# Altium project MU_MP_39_V1.PrjPcb (part 3 of 5)

## Sheet 09 EMMC.SchDoc
size 420 x 297 mm; Address1: Address1; Address2: Address2; Address3: Address3; Address4: Address4; DocumentNumber: АБВГ.123456.001 Э3; SheetNumber: 9; SheetTotal: 23; Scale: 1:1; DocumentType: Схема электрическая принципиальная; FirstReferrence: АБВГ.123456.001
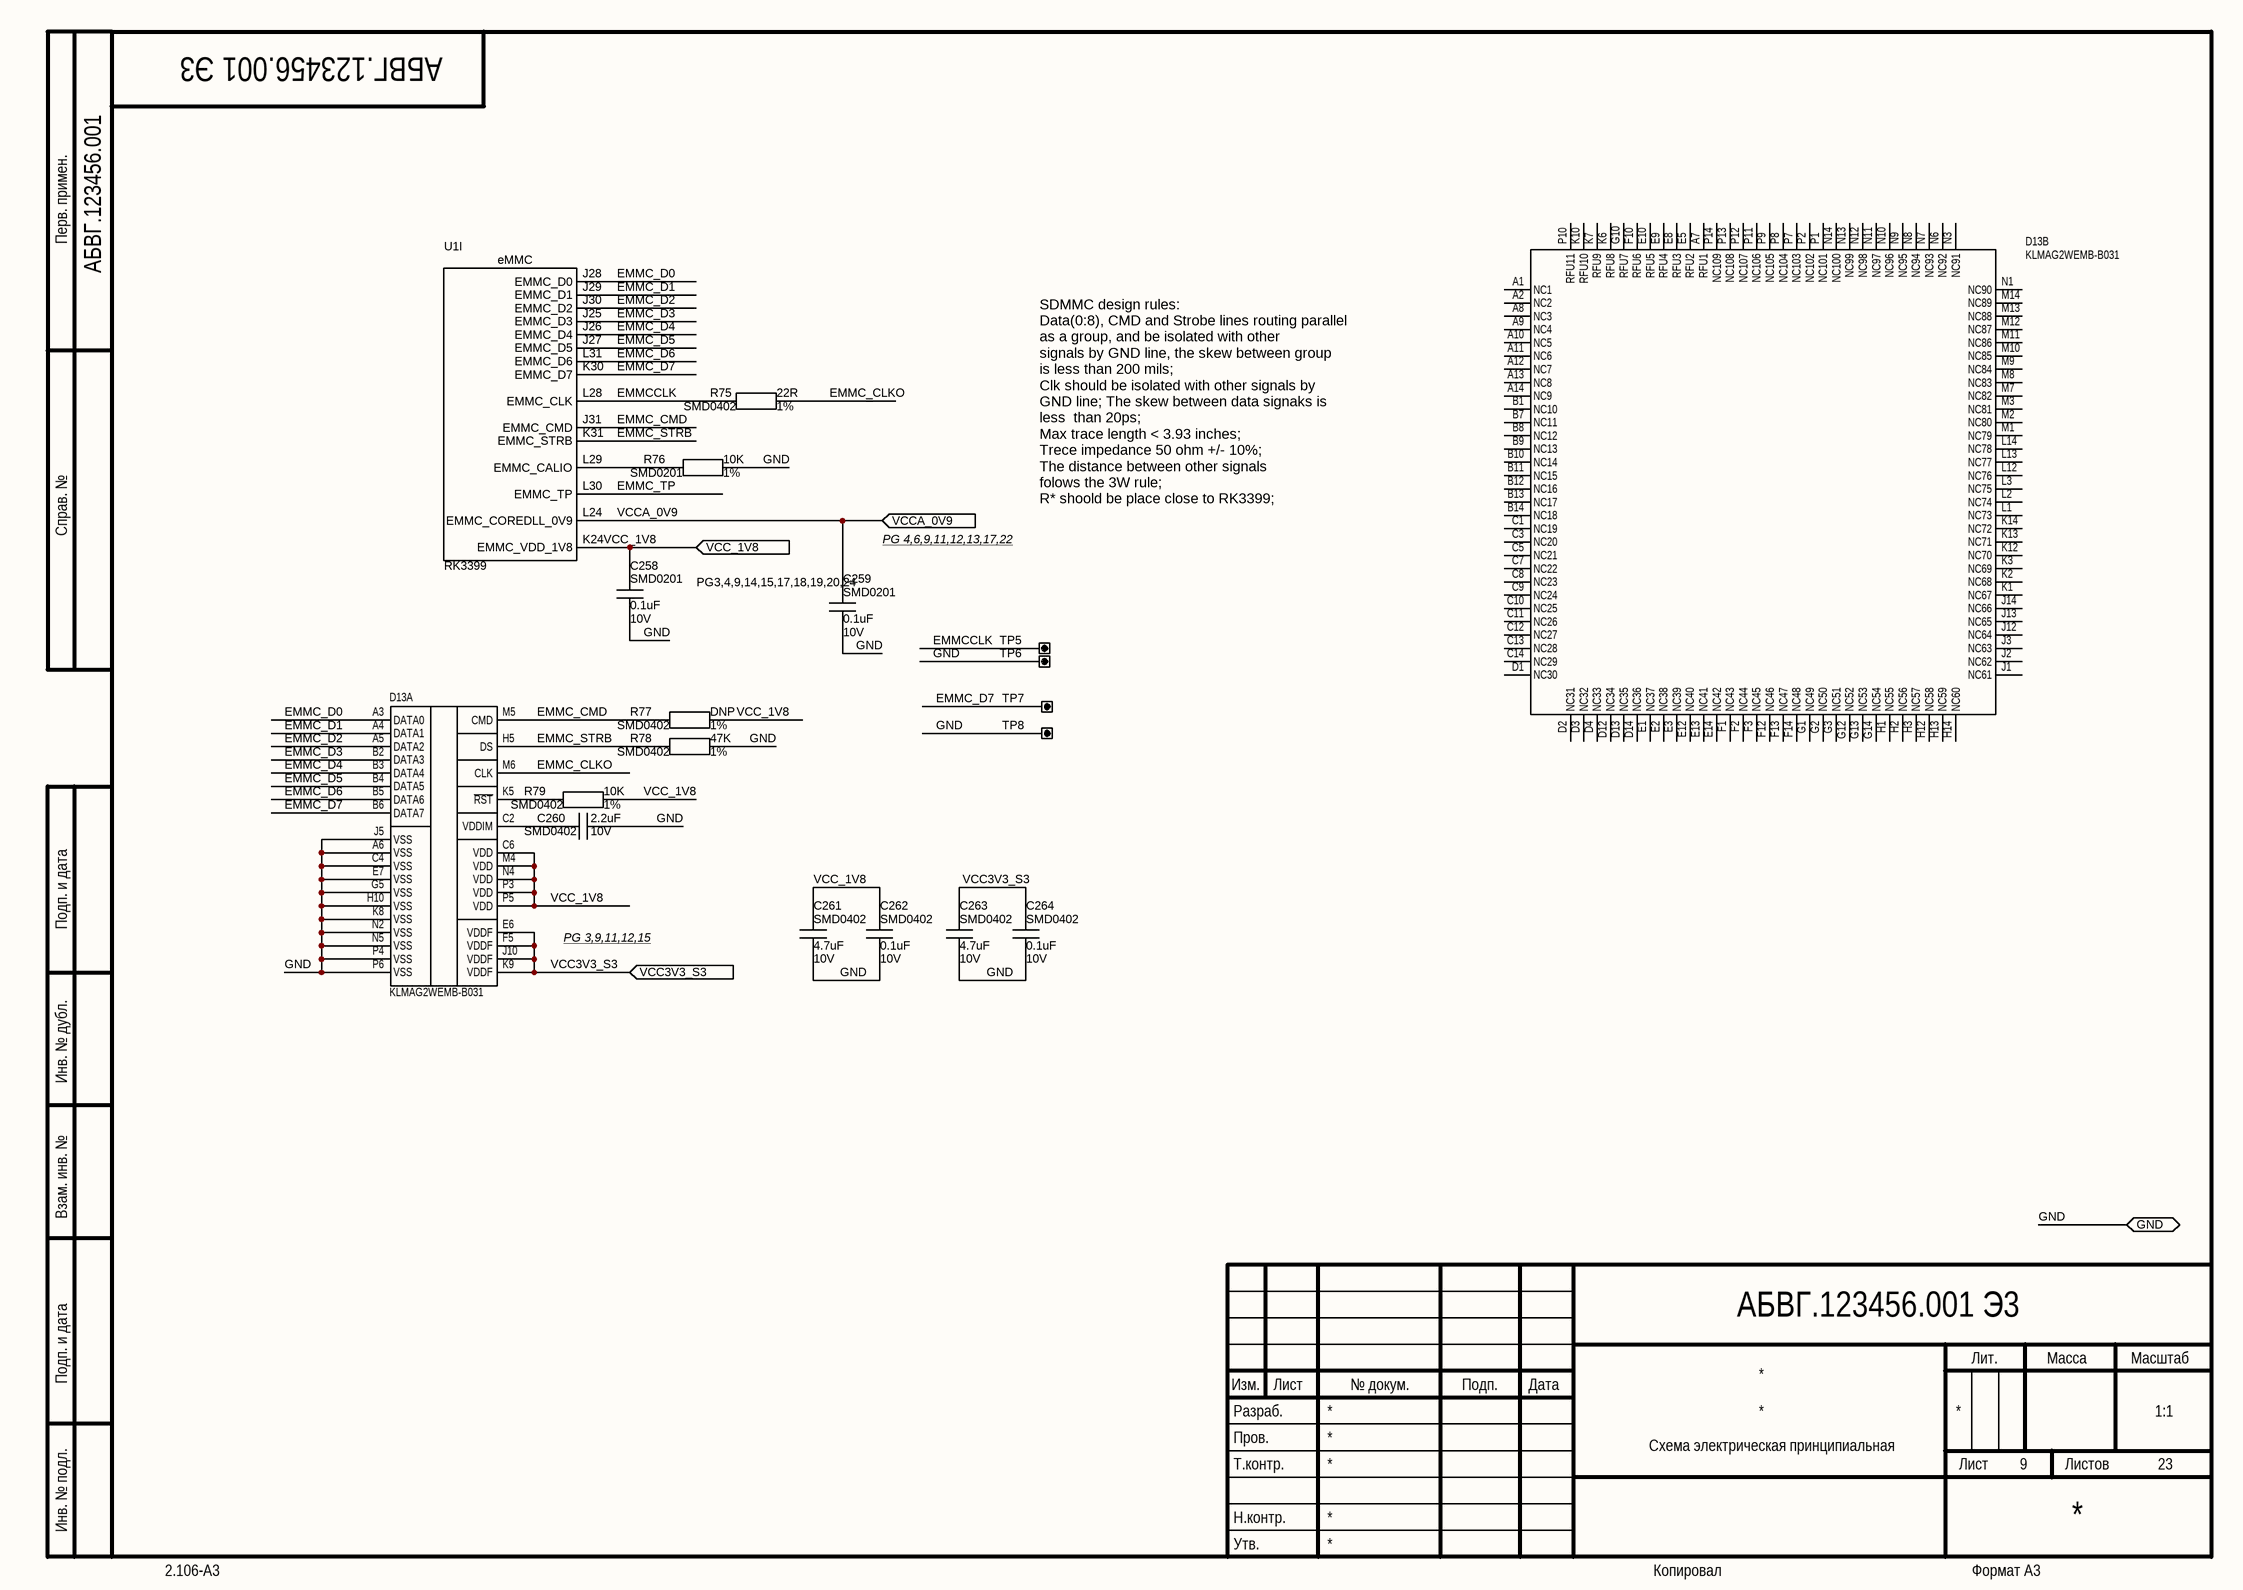
[diagram p8: 09 EMMC.SchDoc]

### Parts
C258  Package: SMD0201  Voltage: 10V  [CAP_SMD_0201]  (hidden comment: 0.1uF)
C259  Package: SMD0201  Voltage: 10V  [CAP_SMD_0201]  (hidden comment: 0.1uF)
C260  Package: SMD0402  Voltage: 10V  [CAP_SMD_0402]  (hidden comment: 2.2uF)
C261  Package: SMD0402  Voltage: 10V  [CAP_SMD_0402]  (hidden comment: 4.7uF)
C262  Package: SMD0402  Voltage: 10V  [CAP_SMD_0402]  (hidden comment: 0.1uF)
C263  Package: SMD0402  Voltage: 10V  [CAP_SMD_0402]  (hidden comment: 4.7uF)
C264  Package: SMD0402  Voltage: 10V  [CAP_SMD_0402]  (hidden comment: 0.1uF)
D13  KLMAG2WEMB-B031  [FBGA153]  (parts A,B of 2)
R75  Package: SMD0402  Tolerance: 1%  [RES_SMD_0402_SMALL]  (hidden comment: 22R)
R76  Package: SMD0201  Tolerance: 1%  [RES_SMD_0201]  (hidden comment: 10K)
R77  Package: SMD0402  Tolerance: 1%  [RES_SMD_0402]  (hidden comment: DNP)
R78  Package: SMD0402  Tolerance: 1%  [RES_SMD_0402]  (hidden comment: 47K)
R79  Package: SMD0402  Tolerance: 1%  [RES_SMD_0402]  (hidden comment: 10K)
TP5  TEST POINT SMD 1MM  [TEST POINT SMD 1MM]  (value not drawn)
TP6  TEST POINT SMD 1MM  [TEST POINT SMD 1MM]  (value not drawn)
TP7  TEST POINT SMD 1MM  [TEST POINT SMD 1MM]  (value not drawn)
TP8  TEST POINT SMD 1MM  [TEST POINT SMD 1MM]  (value not drawn)
U1  value RK3399  [BGA828C65P31X31_2100X2100X161N]  (hidden comment: RK3399_FF)  (part I of 23)

### Ports
GND (bidir), VCC3V3_S3 (in), VCC_1V8 (in), VCCA_0V9 (in)

### Nets
EMMC_CLKO: D13.M6(CLK) R75.1
EMMC_CMD: D13.M5(CMD) R77.1 U1.J31(EMMC_CMD)
EMMC_D0: D13.A3(DATA0) U1.J28(EMMC_D0)
EMMC_D1: D13.A4(DATA1) U1.J29(EMMC_D1)
EMMC_D2: D13.A5(DATA2) U1.J30(EMMC_D2)
EMMC_D3: D13.B2(DATA3) U1.J25(EMMC_D3)
EMMC_D4: D13.B3(DATA4) U1.J26(EMMC_D4)
EMMC_D5: D13.B4(DATA5) U1.J27(EMMC_D5)
EMMC_D6: D13.B5(DATA6) U1.L31(EMMC_D6)
EMMC_D7: D13.B6(DATA7) TP7.1 U1.K30(EMMC_D7)
EMMC_STRB: D13.H5(DS) R78.2 U1.K31(EMMC_STRB)
EMMC_TP: U1.L30(EMMC_TP)
EMMCCLK: R75.2 TP5.1 U1.L28(EMMC_CLK)
GND: C258.2 C259.2 C260.2 C261.1 C262.2 C263.1 C264.2 D13.A6(VSS) D13.C4(VSS) D13.E7(VSS) D13.G5(VSS) D13.H10(VSS) D13.J5(VSS) D13.K8(VSS) D13.N2(VSS) D13.N5(VSS) D13.P4(VSS) D13.P6(VSS) R76.1 R78.1 TP6.1 TP8.1 ; port GND
VCC3V3_S3: C263.2 C264.1 D13.E6(VDDF) D13.F5(VDDF) D13.J10(VDDF) D13.K9(VDDF) ; port VCC3V3_S3
VCC_1V8: C258.1 C261.2 C262.1 D13.C6(VDD) D13.M4(VDD) D13.N4(VDD) D13.P3(VDD) D13.P5(VDD) R77.2 R79.1 U1.K24(EMMC_VDD_1V8) ; port VCC_1V8
VCCA_0V9: C259.1 U1.L24(EMMC_COREDLL_0V9) ; port VCCA_0V9
NetC260_1: C260.1 D13.C2(VDDIM)
NetD13_K5: D13.K5(~{RST}) R79.2
NetR76_2: R76.2 U1.L29(EMMC_CALIO)

Not connected (* = marked no-connect by the designer): D13 A1(NC1) A2(NC2) A7(RFU1) A8(NC3) A9(NC4) A10(NC5) A11(NC6) A12(NC7) A13(NC8) A14(NC9) B1(NC10) B7(NC11) B8(NC12) B9(NC13) B10(NC14) B11(NC15) B12(NC16) B13(NC17) B14(NC18) C1(NC19) C3(NC20) C5(NC21) C7(NC22) C8(NC23) C9(NC24) C10(NC25) C11(NC26) C12(NC27) C13(NC28) C14(NC29) D1(NC30) D2(NC31) D3(NC32) D4(NC33) D12(NC34) D13(NC35) D14(NC36) E1(NC37) E2(NC38) E3(NC39) E5(RFU2) E8(RFU3) E9(RFU4) E10(RFU5) E12(NC40) E13(NC41) E14(NC42) F1(NC43) F2(NC44) F3(NC45) F10(RFU6) F12(NC46) F13(NC47) F14(NC48) G1(NC49) G2(NC50) G3(NC51) G10(RFU7) G12(NC52) G13(NC53) G14(NC54) H1(NC55) H2(NC56) H3(NC57) H12(NC58) H13(NC59) H14(NC60) J1(NC61) J2(NC62) J3(NC63) J12(NC64) J13(NC65) J14(NC66) K1(NC67) K2(NC68) K3(NC69) K6(RFU8) K7(RFU9) K10(RFU10) K12(NC70) K13(NC71) K14(NC72) L1(NC73) L2(NC74) L3(NC75) L12(NC76) L13(NC77) L14(NC78) M1(NC79) M2(NC80) M3(NC81) M7(NC82) M8(NC83) M9(NC84) M10(NC85) M11(NC86) M12(NC87) M13(NC88) M14(NC89) N1(NC90) N3(NC91) N6(NC92) N7(NC93) N8(NC94) N9(NC95) N10(NC96) N11(NC97) N12(NC98) N13(NC99) N14(NC100) P1(NC101) P2(NC102) P7(NC103) P8(NC104) P9(NC105) P10(RFU11) P11(NC106) P12(NC107) P13(NC108) P14(NC109)

### Notes on the sheet
- Перв. примен.
- Справ. №
- SDMMC design rules:
  Data(0:8), CMD and Strobe lines routing parallel
  as a group, and be isolated with other
  signals by GND line, the skew between group
  is less than 200 mils;
  Clk should be isolated with other signals by
  GND line; The skew between data signaks is
  less  than 20ps;
  Max trace length < 3.93 inches;
  Trece impedance 50 ohm +/- 10%;
  The distance between other signals
  folows the 3W rule;
  R* shoold be place close to RK3399;
- PG 4,6,9,11,12,13,17,22
- (near C259) PG3,4,9,14,15,17,18,19,20,24
- Подп. и дата
- PG 3,9,11,12,15
- Инв. № дубл.
- Взам. инв. №
- Разраб.
- Изм.
- Лист
- № докум.
- Подп.
- Дата
- Лит.
- Масса
- Масштаб
- Пров.
- Т.контр.
- Листов
- Инв. № подл.
- Утв.
- Н.контр.
- 2.106-A3
- Копировал
- Формат А3
- (in symbol RK3399_FF, part I) eMMC

### Library data of the parts
C258 C259 = Ceramic_Cap: PartNumber: CC0201KRX5R6BB104; ComponentType: SMD Ceramic Chip Capacitor; Manufacter: *; Tolerance: *; ClassName: *; Value: 0.1uF
C260 = Ceramic_Cap: PartNumber: CC0402KRX5R6BB225; ComponentType: SMD Ceramic Chip Capacitor; Manufacter: *; Tolerance: *; ClassName: *; Value: 2.2uF
C261 C263 = Ceramic_Cap: PartNumber: CL05A475KP5NRNC; ComponentType: SMD Ceramic Chip Capacitor; Manufacter: *; Tolerance: *; ClassName: *; Value: 4.7uF
C262 C264 = Ceramic_Cap: PartNumber: CC0402KRX5R6BB104; ComponentType: SMD Ceramic Chip Capacitor; Manufacter: *; Tolerance: *; ClassName: *; Value: 0.1uF
R75 = Chip_Res: PartNumber: RC0402FR-0722RL; ComponentType: SMD Chip Resistor; Manufacter: *; Voltage: *; ClassName: Solder_Clearence; Value: 22R
R76 = Chip_Res: PartNumber: RC0201FR-0710KL; ComponentType: SMD Chip Resistor; Manufacter: *; Voltage: *; ClassName: *; Value: 10K
R77 = Chip_Res: PartNumber: Do Not Place; ComponentType: SMD Chip Resistor; Manufacter: *; Voltage: *; ClassName: *; Value: DNP
R78 = Chip_Res: PartNumber: RC0402FR-1347KL; ComponentType: SMD Chip Resistor; Manufacter: *; Voltage: *; ClassName: *; Value: 47K
R79 = Chip_Res: PartNumber: RC0402FR-0710KL; ComponentType: SMD Chip Resistor; Manufacter: *; Voltage: *; ClassName: *; Value: 10K
TP5-TP8 = TP: ComponentType: *; Manufacter: *; Package: TEST POINT SMD 1MM; PartNumber: TEST POINT SMD 1MM; ClassName: *; Value: TEST POINT SMD 1MM
D13 = KLMAG2WEMB-B031: ComponentType: *; Manufacter: *; Package: FBGA153; PartNumber: KLMAG2WEMB-B031; ClassName: *; Value: KLMAG2WEMB-B031
U1 = RK3399_FF: Package: BGA828; ComponentType: *; Manufacter: *; PartNumber: RK3399; ClassName: *

## Sheet 10 SDMMC.SchDoc
size 420 x 297 mm; Address1: Address1; Address2: Address2; Address3: Address3; Address4: Address4; DocumentNumber: АБВГ.123456.001 Э3; SheetNumber: 10; SheetTotal: 23; Scale: 1:1; DocumentType: Схема электрическая принципиальная; FirstReferrence: АБВГ.123456.001
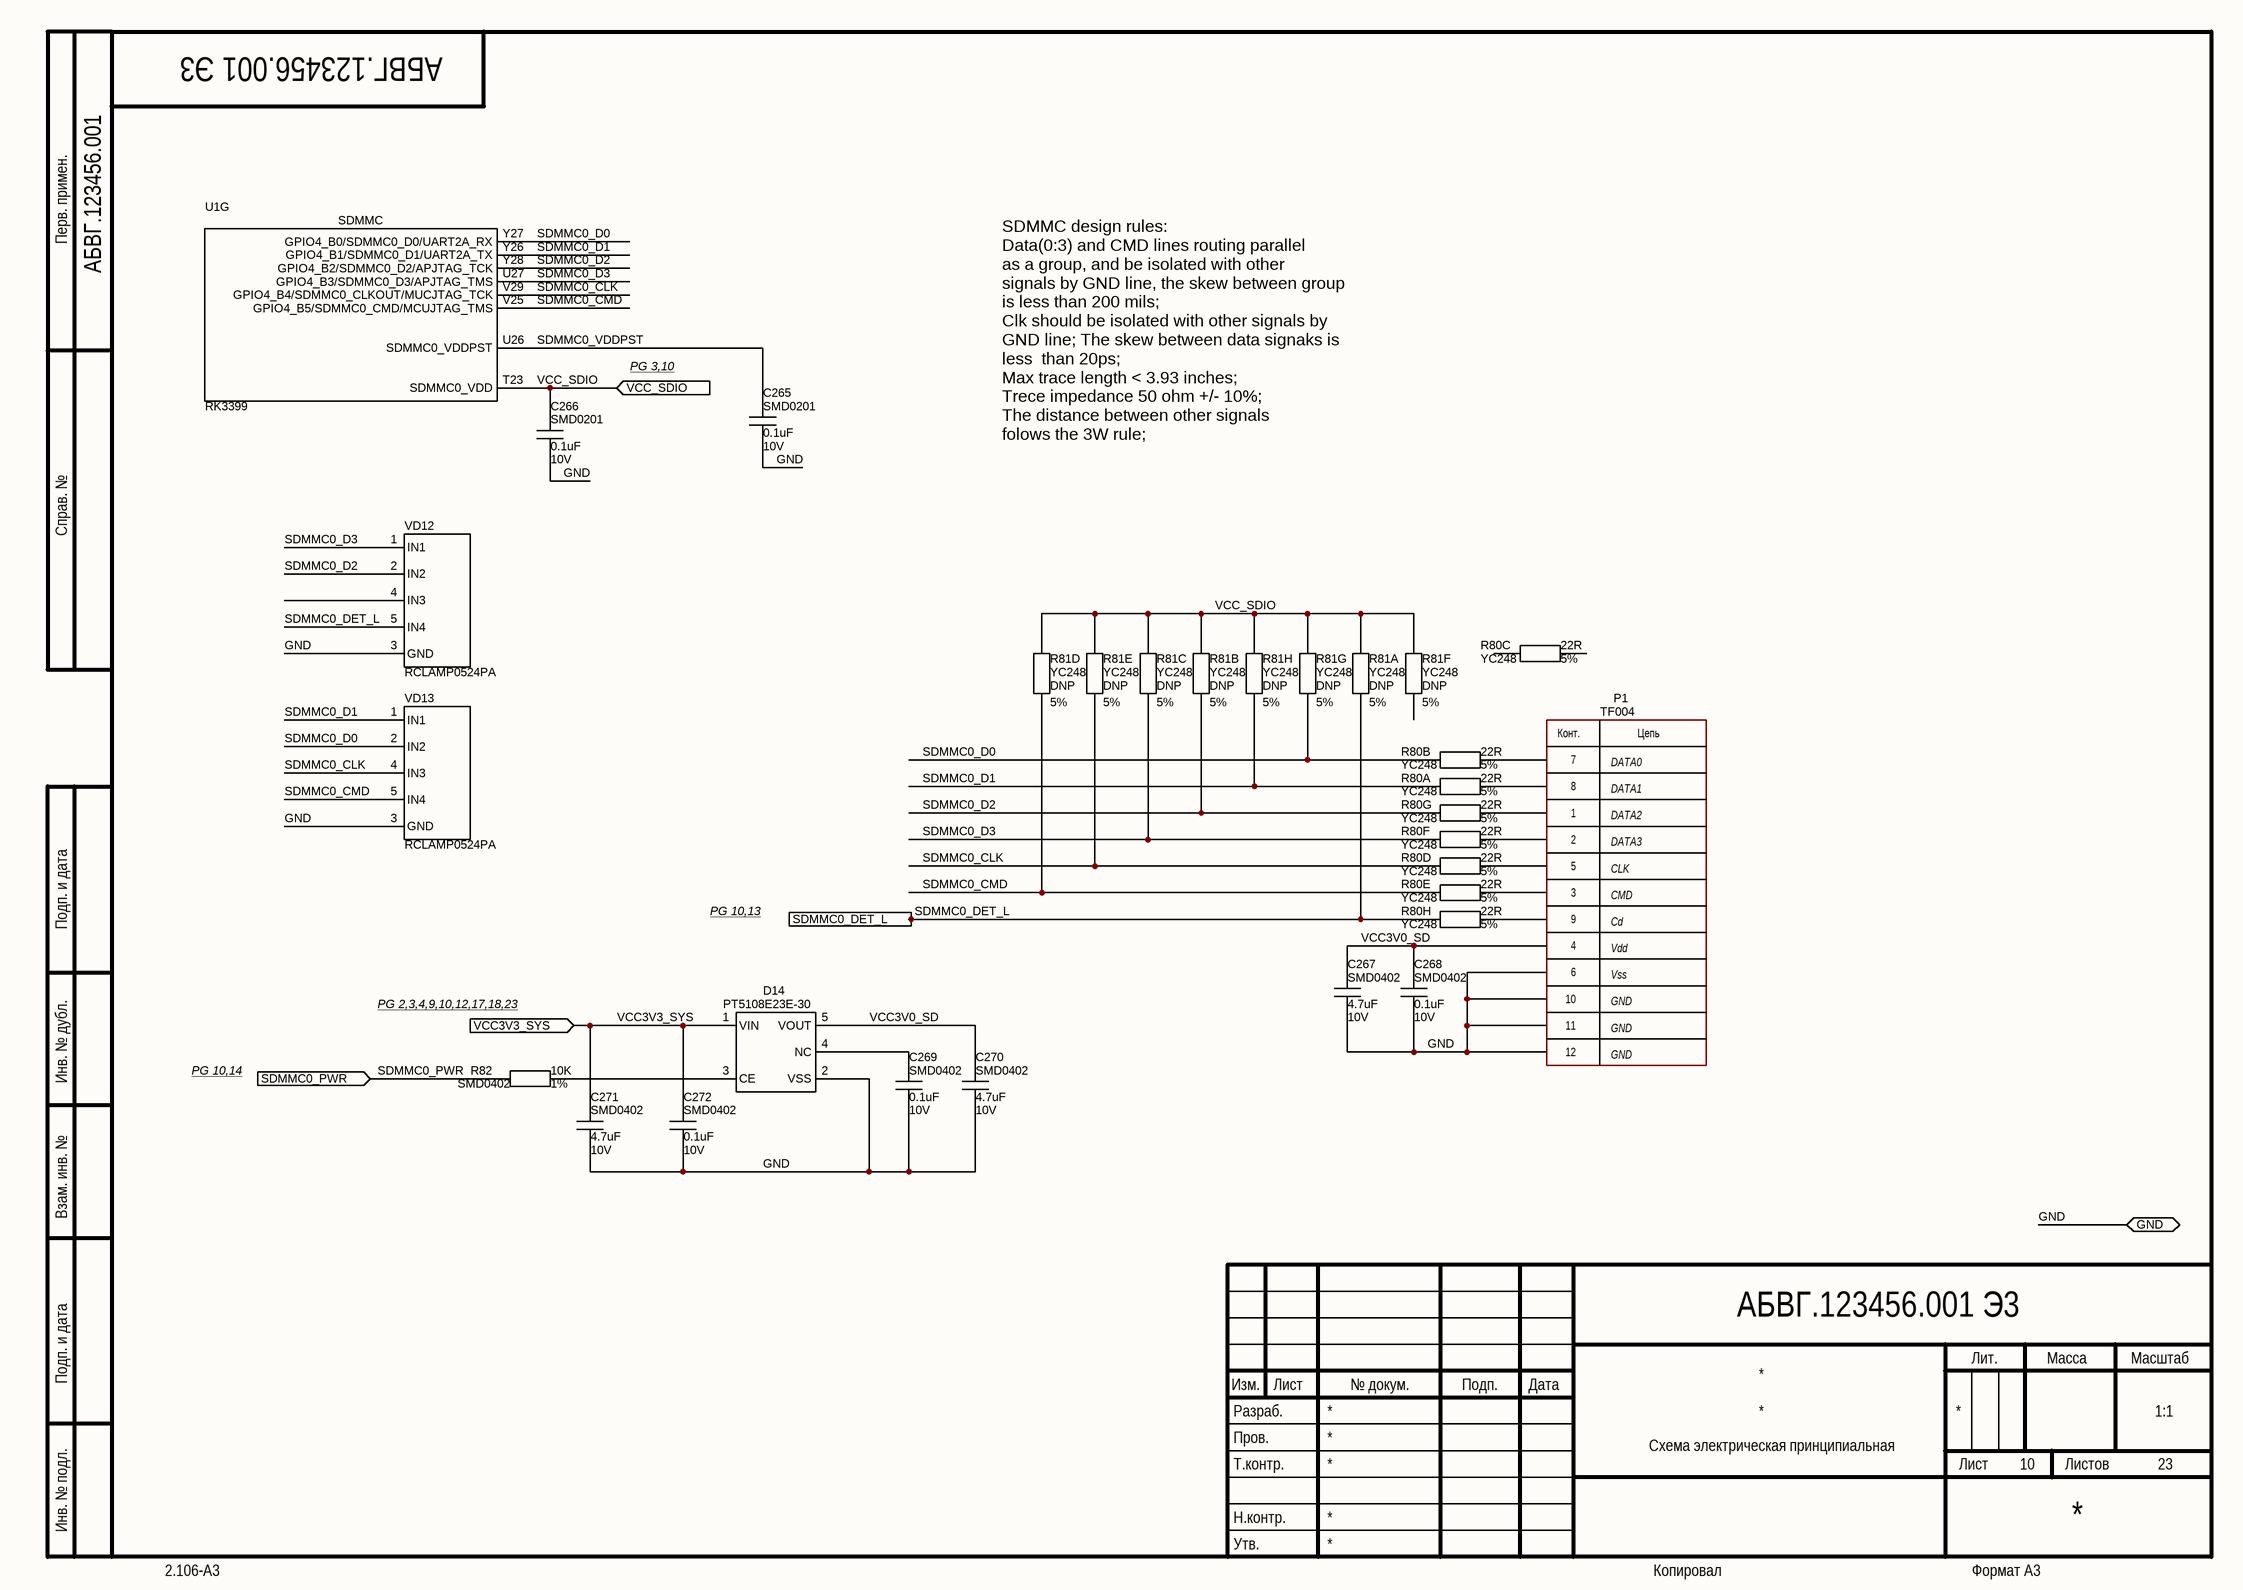
[diagram p9: 10 SDMMC.SchDoc]

### Parts
C265  Package: SMD0201  Voltage: 10V  [CAP_SMD_0201]  (hidden comment: 0.1uF)
C266  Package: SMD0201  Voltage: 10V  [CAP_SMD_0201]  (hidden comment: 0.1uF)
C267  Package: SMD0402  Voltage: 10V  [CAP_SMD_0402]  (hidden comment: 4.7uF)
C268  Package: SMD0402  Voltage: 10V  [CAP_SMD_0402]  (hidden comment: 0.1uF)
C269  Package: SMD0402  Voltage: 10V  [CAP_SMD_0402]  (hidden comment: 0.1uF)
C270  Package: SMD0402  Voltage: 10V  [CAP_SMD_0402]  (hidden comment: 4.7uF)
C271  Package: SMD0402  Voltage: 10V  [CAP_SMD_0402]  (hidden comment: 4.7uF)
C272  Package: SMD0402  Voltage: 10V  [CAP_SMD_0402]  (hidden comment: 0.1uF)
D14  PT5108E23E-30  [SOT23-5]
P1  TF004  [TF004]
R80  Tolerance: 5%  [YC248]  (hidden comment: 22R)  (parts A,B,C,D,E,F,G,H of 8)
R81  Tolerance: 5%  [YC248]  (hidden comment: DNP)  (parts A,B,C,D,E,F,G,H of 8)
R82  Package: SMD0402  Tolerance: 1%  [RES_SMD_0402]  (hidden comment: 10K)
U1  value RK3399  [BGA828C65P31X31_2100X2100X161N]  (hidden comment: RK3399_FF)  (part G of 23)
VD12  RCLAMP0524PA  [RCLAMP0524PA]
VD13  RCLAMP0524PA  [RCLAMP0524PA]

### Ports
GND (bidir), SDMMC0_DET_L (out), SDMMC0_PWR (in), VCC3V3_SYS (in), VCC_SDIO (in)

### Nets
GND: C265.2 C266.2 C267.1 C268.2 C269.2 C270.1 C271.1 C272.2 D14.2(VSS) P1.6 P1.10 P1.11 P1.12 VD12.3(GND) VD13.3(GND) ; port GND
SDMMC0_CLK: R80.13 R81.12 U1.V29(GPIO4_B4/SDMMC0_CLKOUT/MUCJTAG_TCK) VD13.4(IN3)
SDMMC0_CMD: R80.12 R81.13 U1.V25(GPIO4_B5/SDMMC0_CMD/MCUJTAG_TMS) VD13.5(IN4)
SDMMC0_D0: R80.15 R81.10 U1.Y27(GPIO4_B0/SDMMC0_D0/UART2A_RX) VD13.2(IN2)
SDMMC0_D1: R80.16 R81.9 U1.Y26(GPIO4_B1/SDMMC0_D1/UART2A_TX) VD13.1(IN1)
SDMMC0_D2: R80.10 R81.15 U1.Y28(GPIO4_B2/SDMMC0_D2/APJTAG_TCK) VD12.2(IN2)
SDMMC0_D3: R80.11 R81.14 U1.U27(GPIO4_B3/SDMMC0_D3/APJTAG_TMS) VD12.1(IN1)
SDMMC0_DET_L: R80.9 R81.16 VD12.5(IN4) ; port SDMMC0_DET_L
SDMMC0_PWR: R82.2 ; port SDMMC0_PWR
SDMMC0_VDDPST: C265.1 U1.U26(SDMMC0_VDDPST)
VCC3V0_SD: C267.2 C268.1 C270.2 D14.5(VOUT) P1.4
VCC3V3_SYS: C271.2 C272.1 D14.1(VIN) ; port VCC3V3_SYS
VCC_SDIO: C266.1 R81.1 R81.2 R81.3 R81.4 R81.5 R81.6 R81.7 R81.8 U1.T23(SDMMC0_VDD) ; port VCC_SDIO
NetC269_1: C269.1 D14.4(NC)
NetD14_3: D14.3(CE) R82.1
NetP1_1: P1.1 R80.7
NetP1_2: P1.2 R80.6
NetP1_3: P1.3 R80.5
NetP1_5: P1.5 R80.4
NetP1_7: P1.7 R80.2
NetP1_8: P1.8 R80.1
NetP1_9: P1.9 R80.8

Not connected (* = marked no-connect by the designer): R80 3 14; R81 11; VD12 4(IN3)

### Notes on the sheet
- Перв. примен.
- PG 3,10
- SDMMC design rules:
  Data(0:3) and CMD lines routing parallel
  as a group, and be isolated with other
  signals by GND line, the skew between group
  is less than 200 mils;
  Clk should be isolated with other signals by
  GND line; The skew between data signaks is
  less  than 20ps;
  Max trace length < 3.93 inches;
  Trece impedance 50 ohm +/- 10%;
  The distance between other signals
  folows the 3W rule;
- Справ. №
- Подп. и дата
- PG 10,13
- PG 2,3,4,9,10,12,17,18,23
- Инв. № дубл.
- PG 10,14
- Взам. инв. №
- Разраб.
- Изм.
- Лист
- № докум.
- Подп.
- Дата
- Лит.
- Масса
- Масштаб
- Пров.
- Т.контр.
- Листов
- Инв. № подл.
- Утв.
- Н.контр.
- 2.106-A3
- Копировал
- Формат А3
- (in symbol MicroSD 9E) Конт.; Цепь; DATA0; DATA1; DATA2; DATA3; CLK; CMD; Cd; Vdd; Vss; GND
- (in symbol RK3399_FF, part G) SDMMC

### Library data of the parts
C265 C266 = Ceramic_Cap: PartNumber: CC0201KRX5R6BB104; ComponentType: SMD Ceramic Chip Capacitor; Manufacter: *; Tolerance: *; ClassName: *; Value: 0.1uF
C267 C270 C271 = Ceramic_Cap: PartNumber: CL05A475KP5NRNC; ComponentType: SMD Ceramic Chip Capacitor; Manufacter: *; Tolerance: *; ClassName: *; Value: 4.7uF
C268 C269 C272 = Ceramic_Cap: PartNumber: CC0402KRX5R6BB104; ComponentType: SMD Ceramic Chip Capacitor; Manufacter: *; Tolerance: *; ClassName: *; Value: 0.1uF
P1 = MicroSD 9E: ComponentType: MicroSD conector; Manufacter: *; Package: TF004; PartNumber: TF004; Value: TF004
R80 = YC248: PartNumber: YC248-JR-0722RL; ComponentType: *; Manufacter: *; Package: YC248; ClassName: *; Value: 22R
R81 = YC248: PartNumber: Do Not Place; ComponentType: *; Manufacter: *; Package: YC248; ClassName: *; Value: DNP
R82 = Chip_Res: PartNumber: RC0402FR-0710KL; ComponentType: SMD Chip Resistor; Manufacter: *; Voltage: *; ClassName: *; Value: 10K
D14 = PT5108E23E-30: ComponentType: SMD Chip Resistor; Manufacter: *; Voltage: *; ClassName: *; Tolerance: *; PartNumber: PT5108E23E-30; Package: SOT23-5; Value: PT5108E23E-30
U1 = RK3399_FF: Package: BGA828; ComponentType: *; Manufacter: *; PartNumber: RK3399; ClassName: *
VD12 VD13 = RCLAMP0524PA: ComponentType: *; Manufacter: *; Package: RCLAMP0524PA; PartNumber: RCLAMP0524PA; ClassName: *; Value: RCLAMP0524PA

## Sheet 11 USB_2.SchDoc
size 420 x 297 mm; Address1: Address1; Address2: Address2; Address3: Address3; Address4: Address4; DocumentNumber: АБВГ.123456.001 Э3; SheetNumber: 11; SheetTotal: 23; Scale: 1:1; DocumentType: Схема электрическая принципиальная; FirstReferrence: АБВГ.123456.001
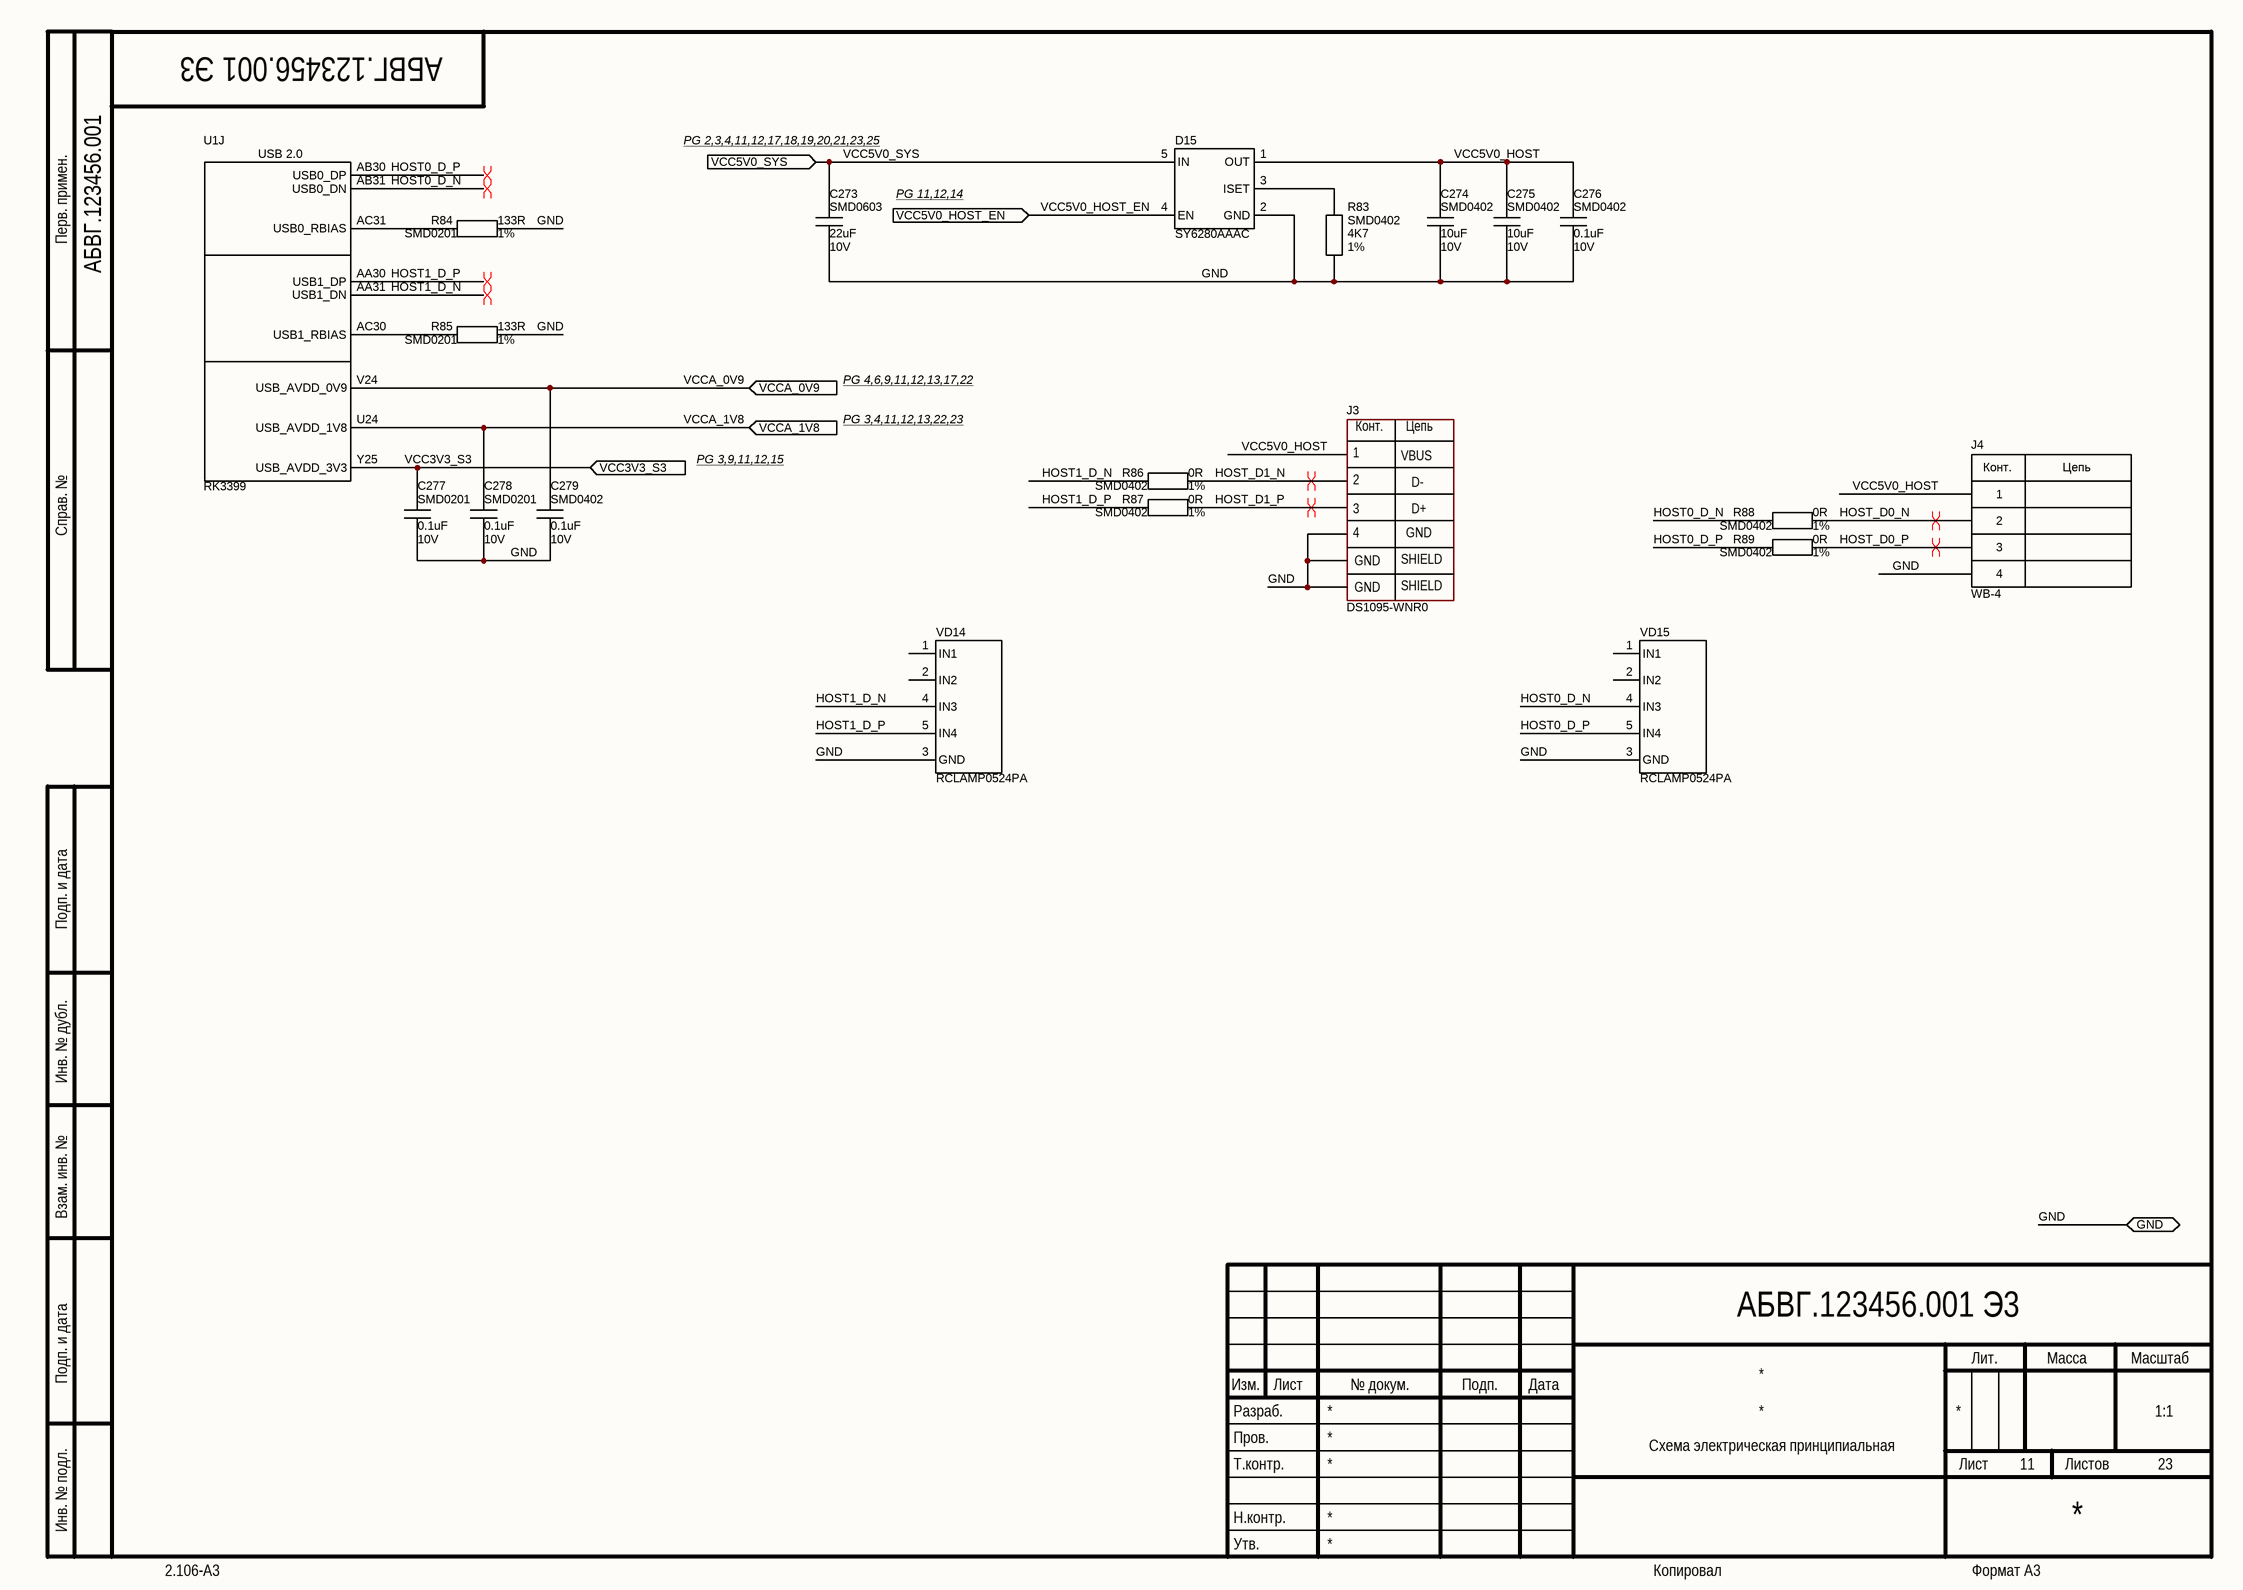
[diagram p10: 11 USB_2.SchDoc]

### Parts
C273  Package: SMD0603  Voltage: 10V  [CAP_SMD_0603]  (hidden comment: 22uF)
C274  Package: SMD0402  Voltage: 10V  [CAP_SMD_0402]  (hidden comment: 10uF)
C275  Package: SMD0402  Voltage: 10V  [CAP_SMD_0402]  (hidden comment: 10uF)
C276  Package: SMD0402  Voltage: 10V  [CAP_SMD_0402]  (hidden comment: 0.1uF)
C277  Package: SMD0201  Voltage: 10V  [CAP_SMD_0201]  (hidden comment: 0.1uF)
C278  Package: SMD0201  Voltage: 10V  [CAP_SMD_0201]  (hidden comment: 0.1uF)
C279  Package: SMD0402  Voltage: 10V  [CAP_SMD_0402]  (hidden comment: 0.1uF)
D15  SY6280AAAC  [SOT23-5]
J3  DS1095-WNR0  [DS1095-WNR0]
J4  WB-4  [WB-4]
R83  Package: SMD0402  Tolerance: 1%  [RES_SMD_0402]  (hidden comment: 4K7)
R84  Package: SMD0201  Tolerance: 1%  [RES_SMD_0201]  (hidden comment: 133R)
R85  Package: SMD0201  Tolerance: 1%  [RES_SMD_0201]  (hidden comment: 133R)
R86  Package: SMD0402  Tolerance: 1%  [RES_SMD_0402]  (hidden comment: 0R)
R87  Package: SMD0402  Tolerance: 1%  [RES_SMD_0402]  (hidden comment: 0R)
R88  Package: SMD0402  Tolerance: 1%  [RES_SMD_0402]  (hidden comment: 0R)
R89  Package: SMD0402  Tolerance: 1%  [RES_SMD_0402]  (hidden comment: 0R)
U1  value RK3399  [BGA828C65P31X31_2100X2100X161N]  (hidden comment: RK3399_FF)  (part J of 23)
VD14  RCLAMP0524PA  [RCLAMP0524PA]
VD15  RCLAMP0524PA  [RCLAMP0524PA]

### Ports
GND (bidir), VCC3V3_S3 (in), VCC5V0_HOST_EN (in), VCC5V0_SYS (in), VCCA_0V9 (in), VCCA_1V8 (in)

### Nets
GND: C273.1 C274.2 C275.2 C276.2 C277.2 C278.2 C279.2 D15.2(GND) J3.4 J3.S1(GND) J3.S2(GND) J4.4 R83.2 R84.1 R85.1 VD14.3(GND) VD15.3(GND) ; port GND
HOST0_D_N: R88.1 U1.AB31(USB0_DN) VD15.4(IN3)
HOST0_D_P: R89.1 U1.AB30(USB0_DP) VD15.5(IN4)
HOST1_D_N: R86.1 U1.AA31(USB1_DN) VD14.4(IN3)
HOST1_D_P: R87.1 U1.AA30(USB1_DP) VD14.5(IN4)
HOST_D0_N: J4.2 R88.2
HOST_D0_P: J4.3 R89.2
HOST_D1_N: J3.2 R86.2
HOST_D1_P: J3.3 R87.2
VCC3V3_S3: C277.1 U1.Y25(USB_AVDD_3V3) ; port VCC3V3_S3
VCC5V0_HOST: C274.1 C275.1 C276.1 D15.1(OUT) J3.1 J4.1
VCC5V0_HOST_EN: D15.4(EN) ; port VCC5V0_HOST_EN
VCC5V0_SYS: C273.2 D15.5(IN) ; port VCC5V0_SYS
VCCA_0V9: C279.1 U1.V24(USB_AVDD_0V9) ; port VCCA_0V9
VCCA_1V8: C278.1 U1.U24(USB_AVDD_1V8) ; port VCCA_1V8
NetD15_3: D15.3(ISET) R83.1
NetR84_2: R84.2 U1.AC31(USB0_RBIAS)
NetR85_2: R85.2 U1.AC30(USB1_RBIAS)

Not connected (* = marked no-connect by the designer): VD14 1(IN1) 2(IN2); VD15 1(IN1) 2(IN2)

### Layout directives
differential pair; differential pair class DiffPair_90_Ohms; net class DiffPair_90_Ohms: HOST0_D_P
differential pair; net class DiffPair_90_Ohms; net class DiffPair_90_Ohms; differential pair class DiffPair_90_Ohms; net class DiffPair_90_Ohms: HOST0_D_N, HOST1_D_N, HOST1_D_P, HOST_D1_N, HOST_D1_P
differential pair: HOST_D0_N, HOST_D0_P

### Notes on the sheet
- PG 2,3,4,11,12,17,18,19,20,21,23,25
- Перв. примен.
- PG 11,12,14
- PG 4,6,9,11,12,13,17,22
- PG 3,9,11,12,15
- PG 3,4,11,12,13,22,23
- Справ. №
- Подп. и дата
- Инв. № дубл.
- Взам. инв. №
- Разраб.
- Изм.
- Лист
- № докум.
- Подп.
- Дата
- Лит.
- Масса
- Масштаб
- Пров.
- Т.контр.
- Листов
- Инв. № подл.
- Утв.
- Н.контр.
- 2.106-A3
- Копировал
- Формат А3
- (in symbol CON4) Конт.; Цепь
- (in symbol RK3399_FF, part J) USB 2.0
- (in symbol USBA-1J) Конт.; Цепь; VBUS; D-; D+; SHIELD

### Library data of the parts
C273 = Ceramic_Cap: PartNumber: CL10A226MP8NUNE; ComponentType: SMD Ceramic Chip Capacitor; Manufacter: *; Tolerance: *; ClassName: *; Value: 22uF
C274 C275 = Ceramic_Cap: PartNumber: CC0402MRX5R6BB106; ComponentType: SMD Ceramic Chip Capacitor; Manufacter: *; Tolerance: *; ClassName: *; Value: 10uF
C276 C279 = Ceramic_Cap: PartNumber: CC0402KRX5R6BB104; ComponentType: SMD Ceramic Chip Capacitor; Manufacter: *; Tolerance: *; ClassName: *; Value: 0.1uF
C277 C278 = Ceramic_Cap: PartNumber: CC0201KRX5R6BB104; ComponentType: SMD Ceramic Chip Capacitor; Manufacter: *; Tolerance: *; ClassName: *; Value: 0.1uF
J3 = USBA-1J: ComponentType: *; Manufacter: *; Package: DS1095-WNR0; PartNumber: DS1095-WNR0; Value: DS1095-WNR0
J4 = CON4: PartNumber: DS1066-04M(MW-4M); Manufacter: *; Package: WB-4; ClassName: *; Value: WB-4
R83 = Chip_Res: PartNumber: RC0402FR-074K7L; ComponentType: SMD Chip Resistor; Manufacter: *; Voltage: *; ClassName: *; Value: 4K7
R84 R85 = Chip_Res: PartNumber: RC0201FR-07133RL; ComponentType: SMD Chip Resistor; Manufacter: *; Voltage: *; ClassName: *; Value: 133R
R86-R89 = Chip_Res: PartNumber: RC0402FR-070RL; ComponentType: SMD Chip Resistor; Manufacter: *; Voltage: *; ClassName: *; Value: 0R
D15 = SY6280AAAC: ComponentType: SMD Chip Resistor; Manufacter: *; Voltage: *; ClassName: *; Tolerance: *; PartNumber: SY6280AAAC; Package: SOT23-5; Value: SY6280AAAC
U1 = RK3399_FF: Package: BGA828; ComponentType: *; Manufacter: *; PartNumber: RK3399; ClassName: *
VD14 VD15 = RCLAMP0524PA: ComponentType: *; Manufacter: *; Package: RCLAMP0524PA; PartNumber: RCLAMP0524PA; ClassName: *; Value: RCLAMP0524PA

## Sheet 12 USB_3.SchDoc
size 420 x 297 mm; Address1: Address1; Address2: Address2; Address3: Address3; Address4: Address4; DocumentNumber: АБВГ.123456.001 Э3; SheetNumber: 12; SheetTotal: 23; Scale: 1:1; DocumentType: Схема электрическая принципиальная; FirstReferrence: АБВГ.123456.001
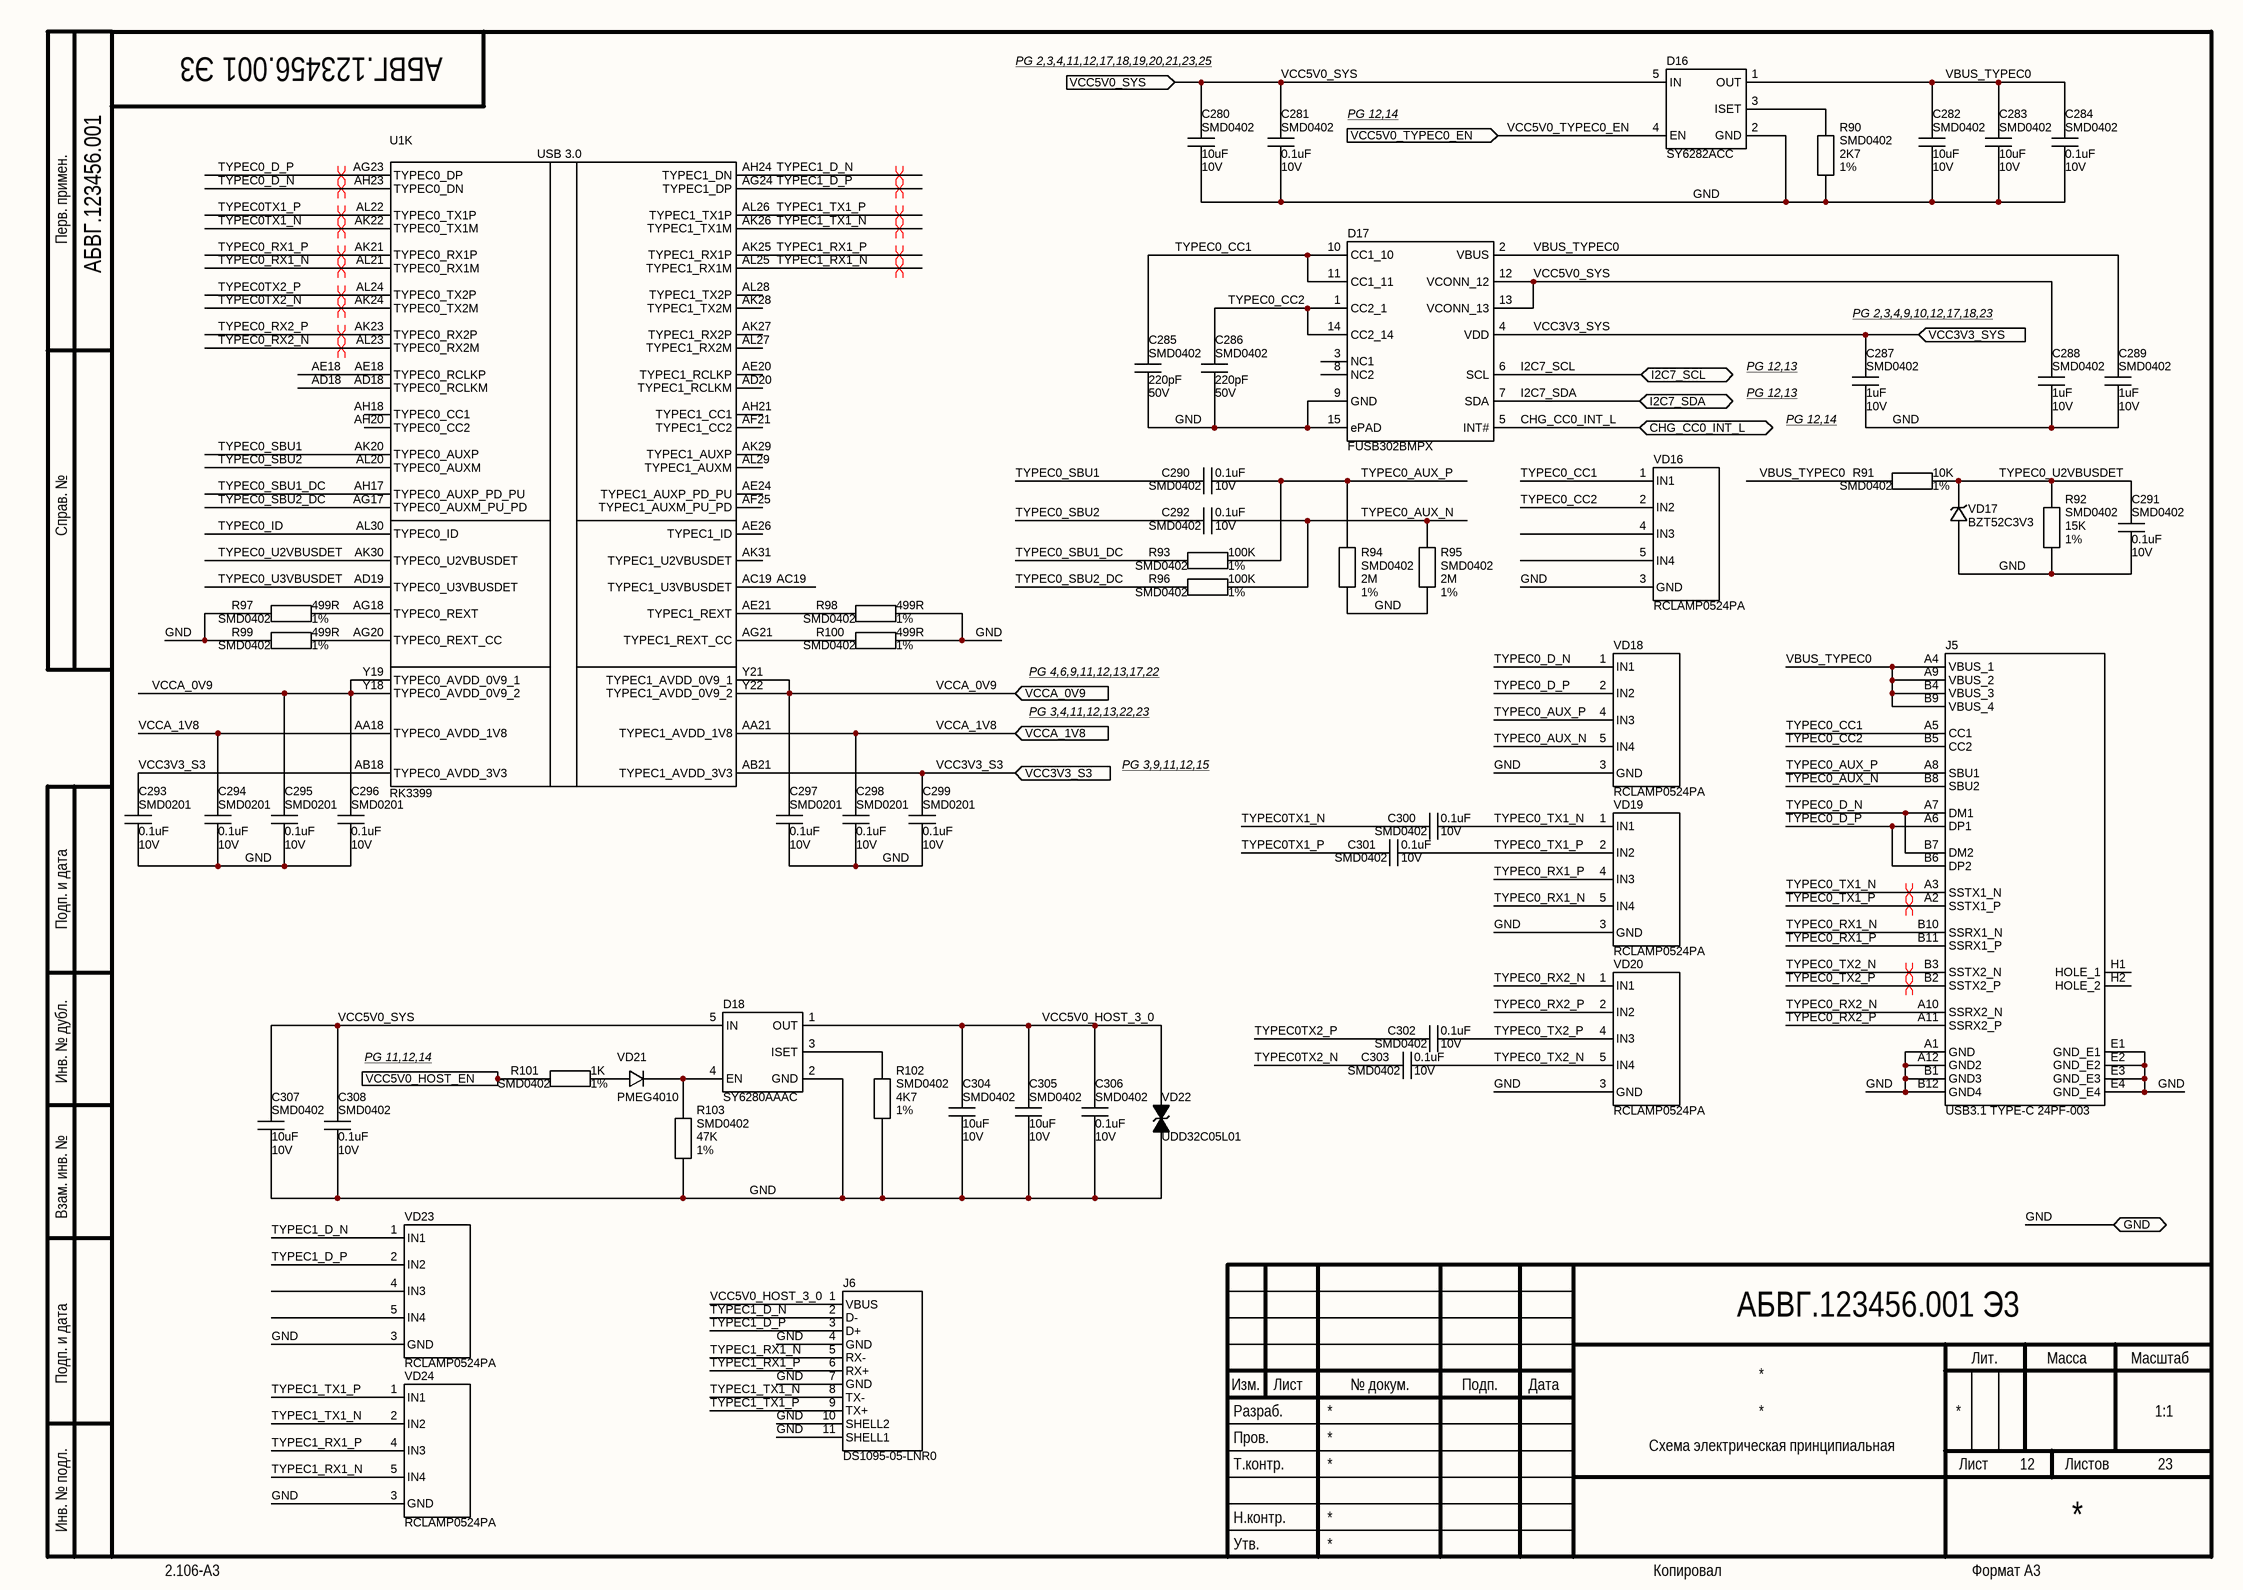
[diagram p11: 12 USB_3.SchDoc]

### Parts
C280  Package: SMD0402  Voltage: 10V  [CAP_SMD_0402]  (hidden comment: 10uF)
C281  Package: SMD0402  Voltage: 10V  [CAP_SMD_0402]  (hidden comment: 0.1uF)
C282  Package: SMD0402  Voltage: 10V  [CAP_SMD_0402]  (hidden comment: 10uF)
C283  Package: SMD0402  Voltage: 10V  [CAP_SMD_0402]  (hidden comment: 10uF)
C284  Package: SMD0402  Voltage: 10V  [CAP_SMD_0402]  (hidden comment: 0.1uF)
C285  Package: SMD0402  Voltage: 50V  [CAP_SMD_0402]  (hidden comment: 220pF)
C286  Package: SMD0402  Voltage: 50V  [CAP_SMD_0402]  (hidden comment: 220pF)
C287  Package: SMD0402  Voltage: 10V  [CAP_SMD_0402]  (hidden comment: 1uF)
C288  Package: SMD0402  Voltage: 10V  [CAP_SMD_0402]  (hidden comment: 1uF)
C289  Package: SMD0402  Voltage: 10V  [CAP_SMD_0402]  (hidden comment: 1uF)
C290  Package: SMD0402  Voltage: 10V  [CAP_SMD_0402]  (hidden comment: 0.1uF)
C291  Package: SMD0402  Voltage: 10V  [CAP_SMD_0402]  (hidden comment: 0.1uF)
C292  Package: SMD0402  Voltage: 10V  [CAP_SMD_0402]  (hidden comment: 0.1uF)
C293  Package: SMD0201  Voltage: 10V  [CAP_SMD_0201]  (hidden comment: 0.1uF)
C294  Package: SMD0201  Voltage: 10V  [CAP_SMD_0201]  (hidden comment: 0.1uF)
C295  Package: SMD0201  Voltage: 10V  [CAP_SMD_0201]  (hidden comment: 0.1uF)
C296  Package: SMD0201  Voltage: 10V  [CAP_SMD_0201]  (hidden comment: 0.1uF)
C297  Package: SMD0201  Voltage: 10V  [CAP_SMD_0201]  (hidden comment: 0.1uF)
C298  Package: SMD0201  Voltage: 10V  [CAP_SMD_0201]  (hidden comment: 0.1uF)
C299  Package: SMD0201  Voltage: 10V  [CAP_SMD_0201]  (hidden comment: 0.1uF)
C300  Package: SMD0402  Voltage: 10V  [CAP_SMD_0402]  (hidden comment: 0.1uF)
C301  Package: SMD0402  Voltage: 10V  [CAP_SMD_0402]  (hidden comment: 0.1uF)
C302  Package: SMD0402  Voltage: 10V  [CAP_SMD_0402]  (hidden comment: 0.1uF)
C303  Package: SMD0402  Voltage: 10V  [CAP_SMD_0402]  (hidden comment: 0.1uF)
C304  Package: SMD0402  Voltage: 10V  [CAP_SMD_0402]  (hidden comment: 10uF)
C305  Package: SMD0402  Voltage: 10V  [CAP_SMD_0402]  (hidden comment: 10uF)
C306  Package: SMD0402  Voltage: 10V  [CAP_SMD_0402]  (hidden comment: 0.1uF)
C307  Package: SMD0402  Voltage: 10V  [CAP_SMD_0402]  (hidden comment: 10uF)
C308  Package: SMD0402  Voltage: 10V  [CAP_SMD_0402]  (hidden comment: 0.1uF)
D16  SY6282ACC  [SOT23-5]
D17  FUSB302BMPX  [WQFN14]
D18  SY6280AAAC  [SOT23-5]
J5  USB3.1 TYPE-C 24PF-003  [USB3.1 TYPE-C 24PF-003]
J6  DS1095-05-LNR0  [DS1095-05-LNR0]
R90  Package: SMD0402  Tolerance: 1%  [RES_SMD_0402]  (hidden comment: 2K7)
R91  Package: SMD0402  Tolerance: 1%  [RES_SMD_0402]  (hidden comment: 10K)
R92  Package: SMD0402  Tolerance: 1%  [RES_SMD_0402]  (hidden comment: 15K)
R93  Package: SMD0402  Tolerance: 1%  [RES_SMD_0402]  (hidden comment: 100K)
R94  Package: SMD0402  Tolerance: 1%  [RES_SMD_0402]  (hidden comment: 2M)
R95  Package: SMD0402  Tolerance: 1%  [RES_SMD_0402]  (hidden comment: 2M)
R96  Package: SMD0402  Tolerance: 1%  [RES_SMD_0402]  (hidden comment: 100K)
R97  Package: SMD0402  Tolerance: 1%  [RES_SMD_0402_SMALL]  (hidden comment: 499R)
R98  Package: SMD0402  Tolerance: 1%  [RES_SMD_0402_SMALL]  (hidden comment: 499R)
R99  Package: SMD0402  Tolerance: 1%  [RES_SMD_0402_SMALL]  (hidden comment: 499R)
R100  Package: SMD0402  Tolerance: 1%  [RES_SMD_0402_SMALL]  (hidden comment: 499R)
R101  Package: SMD0402  Tolerance: 1%  [RES_SMD_0402]  (hidden comment: 1K)
R102  Package: SMD0402  Tolerance: 1%  [RES_SMD_0402]  (hidden comment: 4K7)
R103  Package: SMD0402  Tolerance: 1%  [RES_SMD_0402]  (hidden comment: 47K)
U1  value RK3399  [BGA828C65P31X31_2100X2100X161N]  (hidden comment: RK3399_FF)  (part K of 23)
VD16  RCLAMP0524PA  [RCLAMP0524PA]
VD17  BZT52C3V3  [SOD323]
VD18  RCLAMP0524PA  [RCLAMP0524PA]
VD19  RCLAMP0524PA  [RCLAMP0524PA]
VD20  RCLAMP0524PA  [RCLAMP0524PA]
VD21  value PMEG4010  [SOD323]  (hidden comment: Diode)
VD22  value UDD32C05L01  [SOD323]  (hidden comment: TVS_Diode)
VD23  RCLAMP0524PA  [RCLAMP0524PA]
VD24  RCLAMP0524PA  [RCLAMP0524PA]

### Ports
CHG_CC0_INT_L (bidir), GND (bidir), I2C7_SCL (bidir), I2C7_SDA (bidir), VCC3V3_S3 (in), VCC3V3_SYS (in), VCC5V0_HOST_EN (in), VCC5V0_SYS (in), VCC5V0_TYPEC0_EN (in), VCCA_0V9 (in), VCCA_1V8 (in)

### Nets
AC19: U1.AC19(TYPEC1_U3VBUSDET)
AD18: U1.AD18(TYPEC0_RCLKM)
AE18: U1.AE18(TYPEC0_RCLKP)
CHG_CC0_INT_L: D17.5(INT#) ; port CHG_CC0_INT_L
GND: C280.2 C281.2 C282.2 C283.2 C284.2 C285.2 C286.2 C287.2 C288.2 C289.2 C291.2 C293.2 C294.2 C295.2 C296.2 C297.2 C298.2 C299.2 C304.2 C305.2 C306.2 C307.2 C308.2 D16.2(GND) D17.9(GND) D17.15(ePAD) D18.2(GND) J5.A1(GND) J5.A12(GND2) J5.B1(GND3) J5.B12(GND4) J5.E1(GND_E1) J5.E2(GND_E2) J5.E3(GND_E3) J5.E4(GND_E4) J6.4(GND) J6.7(GND) J6.10(SHELL2) J6.11(SHELL1) R90.2 R92.2 R94.1 R95.1 R97.2 R98.1 R99.2 R100.1 R102.2 R103.2 VD16.3(GND) VD17.1(A) VD18.3(GND) VD19.3(GND) VD20.3(GND) VD22.1(A) VD23.3(GND) VD24.3(GND) ; port GND
I2C7_SCL: D17.6(SCL) ; port I2C7_SCL
I2C7_SDA: D17.7(SDA) ; port I2C7_SDA
TYPEC0_AUX_N: C292.2 J5.B8(SBU2) R95.2 R96.1 VD18.5(IN4)
TYPEC0_AUX_P: C290.2 J5.A8(SBU1) R93.1 R94.2 VD18.4(IN3)
TYPEC0_CC1: C285.1 D17.10(CC1_10) D17.11(CC1_11) J5.A5(CC1) VD16.1(IN1)
TYPEC0_CC2: C286.1 D17.1(CC2_1) D17.14(CC2_14) J5.B5(CC2) VD16.2(IN2)
TYPEC0_D_N: J5.A7(DM1) J5.B7(DM2) U1.AH23(TYPEC0_DN) VD18.1(IN1)
TYPEC0_D_P: J5.A6(DP1) J5.B6(DP2) U1.AG23(TYPEC0_DP) VD18.2(IN2)
TYPEC0_ID: U1.AL30(TYPEC0_ID)
TYPEC0_RX1_N: J5.B10(SSRX1_N) U1.AL21(TYPEC0_RX1M) VD19.5(IN4)
TYPEC0_RX1_P: J5.B11(SSRX1_P) U1.AK21(TYPEC0_RX1P) VD19.4(IN3)
TYPEC0_RX2_N: J5.A10(SSRX2_N) U1.AL23(TYPEC0_RX2M) VD20.1(IN1)
TYPEC0_RX2_P: J5.A11(SSRX2_P) U1.AK23(TYPEC0_RX2P) VD20.2(IN2)
TYPEC0_SBU1: C290.1 U1.AK20(TYPEC0_AUXP)
TYPEC0_SBU1_DC: R93.2 U1.AH17(TYPEC0_AUXP_PD_PU)
TYPEC0_SBU2: C292.1 U1.AL20(TYPEC0_AUXM)
TYPEC0_SBU2_DC: R96.2 U1.AG17(TYPEC0_AUXM_PU_PD)
TYPEC0_TX1_N: C300.2 J5.A3(SSTX1_N) VD19.1(IN1)
TYPEC0_TX1_P: C301.2 J5.A2(SSTX1_P) VD19.2(IN2)
TYPEC0_TX2_N: C303.2 J5.B3(SSTX2_N) VD20.5(IN4)
TYPEC0_TX2_P: C302.2 J5.B2(SSTX2_P) VD20.4(IN3)
TYPEC0_U2VBUSDET: C291.1 R91.1 R92.1 U1.AK30(TYPEC0_U2VBUSDET) VD17.2(C)
TYPEC0_U3VBUSDET: U1.AD19(TYPEC0_U3VBUSDET)
TYPEC0TX1_N: C300.1 U1.AK22(TYPEC0_TX1M)
TYPEC0TX1_P: C301.1 U1.AL22(TYPEC0_TX1P)
TYPEC0TX2_N: C303.1 U1.AK24(TYPEC0_TX2M)
TYPEC0TX2_P: C302.1 U1.AL24(TYPEC0_TX2P)
TYPEC1_D_N: J6.2(D-) U1.AH24(TYPEC1_DN) VD23.1(IN1)
TYPEC1_D_P: J6.3(D+) U1.AG24(TYPEC1_DP) VD23.2(IN2)
TYPEC1_RX1_N: J6.5(RX-) U1.AL25(TYPEC1_RX1M) VD24.5(IN4)
TYPEC1_RX1_P: J6.6(RX+) U1.AK25(TYPEC1_RX1P) VD24.4(IN3)
TYPEC1_TX1_N: J6.8(TX-) U1.AK26(TYPEC1_TX1M) VD24.2(IN2)
TYPEC1_TX1_P: J6.9(TX+) U1.AL26(TYPEC1_TX1P) VD24.1(IN1)
VBUS_TYPEC0: C282.1 C283.1 C284.1 C289.1 D16.1(OUT) D17.2(VBUS) J5.A4(VBUS_1) J5.A9(VBUS_2) J5.B4(VBUS_3) J5.B9(VBUS_4) R91.2
VCC3V3_S3: C293.1 C299.1 U1.AB18(TYPEC0_AVDD_3V3) U1.AB21(TYPEC1_AVDD_3V3) ; port VCC3V3_S3
VCC3V3_SYS: C287.1 D17.4(VDD) ; port VCC3V3_SYS
VCC5V0_HOST_3_0: C304.1 C305.1 C306.1 D18.1(OUT) J6.1(VBUS) VD22.2(C)
VCC5V0_HOST_EN: R101.1 ; port VCC5V0_HOST_EN
VCC5V0_SYS: C280.1 C281.1 C288.1 C307.1 C308.1 D16.5(IN) D17.12(VCONN_12) D17.13(VCONN_13) D18.5(IN) ; port VCC5V0_SYS
VCC5V0_TYPEC0_EN: D16.4(EN) ; port VCC5V0_TYPEC0_EN
VCCA_0V9: C295.1 C296.1 C297.1 U1.Y18(TYPEC0_AVDD_0V9_2) U1.Y19(TYPEC0_AVDD_0V9_1) U1.Y21(TYPEC1_AVDD_0V9_1) U1.Y22(TYPEC1_AVDD_0V9_2) ; port VCCA_0V9
VCCA_1V8: C294.1 C298.1 U1.AA18(TYPEC0_AVDD_1V8) U1.AA21(TYPEC1_AVDD_1V8) ; port VCCA_1V8
NetD16_3: D16.3(ISET) R90.1
NetD18_3: D18.3(ISET) R102.1
NetD18_4: D18.4(EN) R103.1 VD21.2(C)
NetR97_1: R97.1 U1.AG18(TYPEC0_REXT)
NetR98_2: R98.2 U1.AE21(TYPEC1_REXT)
NetR99_1: R99.1 U1.AG20(TYPEC0_REXT_CC)
NetR100_2: R100.2 U1.AG21(TYPEC1_REXT_CC)
NetR101_2: R101.2 VD21.1(A)

Not connected (* = marked no-connect by the designer): D17 3(NC1) 8(NC2); J5 H1(HOLE_1) H2(HOLE_2); U1 AD20(TYPEC1_RCLKM) AE20(TYPEC1_RCLKP) AE24(TYPEC1_AUXP_PD_PU) AE26(TYPEC1_ID) AF21(TYPEC1_CC2) AF25(TYPEC1_AUXM_PU_PD) AH18(TYPEC0_CC1) AH20(TYPEC0_CC2) AH21(TYPEC1_CC1) AK27(TYPEC1_RX2P) AK28(TYPEC1_TX2M) AK29(TYPEC1_AUXP) AK31(TYPEC1_U2VBUSDET) AL27(TYPEC1_RX2M) AL28(TYPEC1_TX2P) AL29(TYPEC1_AUXM); VD16 4(IN3) 5(IN4); VD23 4(IN3) 5(IN4)

### Layout directives
differential pair; differential pair class DiffPair_90_Ohms; net class DiffPair_90_Ohms: TYPEC0_D_N, TYPEC0_D_P, TYPEC0_RX1_N, TYPEC0_RX1_P, TYPEC0_RX2_N, TYPEC0_RX2_P, TYPEC0_TX1_N, TYPEC0_TX1_P, TYPEC0_TX2_N, TYPEC0_TX2_P, TYPEC0TX1_N, TYPEC0TX1_P, TYPEC0TX2_N, TYPEC0TX2_P, TYPEC1_D_N, TYPEC1_D_P, TYPEC1_RX1_N, TYPEC1_RX1_P, TYPEC1_TX1_N, TYPEC1_TX1_P

### Notes on the sheet
- PG 2,3,4,11,12,17,18,19,20,21,23,25
- PG 12,14
- Перв. примен.
- PG 2,3,4,9,10,12,17,18,23
- PG 12,13
- (near C287) PG 12,14
- Справ. №
- PG 3,4,11,12,13,22,23
- PG 4,6,9,11,12,13,17,22
- PG 3,9,11,12,15
- Подп. и дата
- PG 11,12,14
- Инв. № дубл.
- Взам. инв. №
- Разраб.
- Изм.
- Лист
- № докум.
- Подп.
- Дата
- Лит.
- Масса
- Масштаб
- Пров.
- Т.контр.
- Листов
- Инв. № подл.
- Утв.
- Н.контр.
- 2.106-A3
- Копировал
- Формат А3
- (in symbol RK3399_FF, part K) USB 3.0

### Library data of the parts
C280 C282 C283 C304 C305 C307 = Ceramic_Cap: PartNumber: CC0402MRX5R6BB106; ComponentType: SMD Ceramic Chip Capacitor; Manufacter: *; Tolerance: *; ClassName: *; Value: 10uF
C281 C284 C290-C292 C300-C303 C306 C308 = Ceramic_Cap: PartNumber: CC0402KRX5R6BB104; ComponentType: SMD Ceramic Chip Capacitor; Manufacter: *; Tolerance: *; ClassName: *; Value: 0.1uF
C285 C286 = Ceramic_Cap: PartNumber: CC0402JRNPO9BN221; ComponentType: SMD Ceramic Chip Capacitor; Manufacter: *; Tolerance: *; ClassName: *; Value: 220pF
C287-C289 = Ceramic_Cap: PartNumber: CC0402KRX5R6BB105; ComponentType: SMD Ceramic Chip Capacitor; Manufacter: *; Tolerance: *; ClassName: *; Value: 1uF
C293-C299 = Ceramic_Cap: PartNumber: CC0201KRX5R6BB104; ComponentType: SMD Ceramic Chip Capacitor; Manufacter: *; Tolerance: *; ClassName: *; Value: 0.1uF
D16 = SY6280AAAC: ComponentType: SMD Chip Resistor; Manufacter: *; Voltage: *; ClassName: *; Tolerance: *; PartNumber: SY6282ACC; Package: SOT23-5; Value: SY6282ACC
J5 = TYPEC_FUCR-248X-10XX: ComponentType: SMD Chip Resistor; Manufacter: *; Voltage: *; ClassName: *; Tolerance: *; PartNumber: USB3.1 TYPE-C 24PF-003; Package: USB3.1 TYPE-C 24PF-003; Value: USB3.1 TYPE-C 24PF-003
J6 = USB3D0_AF_9P: ComponentType: SMD Chip Resistor; Manufacter: *; Voltage: *; ClassName: *; Tolerance: *; PartNumber: DS1095-05-LNR0; Package: DS1095-05-LNR0; Value: DS1095-05-LNR0
R90 = Chip_Res: PartNumber: RC0402FR-072K7L; ComponentType: SMD Chip Resistor; Manufacter: *; Voltage: *; ClassName: *; Value: 2K7
R91 = Chip_Res: PartNumber: RC0402FR-0710KL; ComponentType: SMD Chip Resistor; Manufacter: *; Voltage: *; ClassName: *; Value: 10K
R92 = Chip_Res: PartNumber: RC0402FR-0715KL; ComponentType: SMD Chip Resistor; Manufacter: *; Voltage: *; ClassName: *; Value: 15K
R93 R96 = Chip_Res: PartNumber: RC0402FR-07100KL; ComponentType: SMD Chip Resistor; Manufacter: *; Voltage: *; ClassName: *; Value: 100K
R94 R95 = Chip_Res: PartNumber: RC0402FR-072ML; ComponentType: SMD Chip Resistor; Manufacter: *; Voltage: *; ClassName: *; Value: 2M
R97-R100 = Chip_Res: PartNumber: RC0402FR-07499RL; ComponentType: SMD Chip Resistor; Manufacter: *; Voltage: *; ClassName: Solder_Clearence; Value: 499R
R101 = Chip_Res: PartNumber: RC0402FR-071KL; ComponentType: SMD Chip Resistor; Manufacter: *; Voltage: *; ClassName: *; Value: 1K
R102 = Chip_Res: PartNumber: RC0402FR-074K7L; ComponentType: SMD Chip Resistor; Manufacter: *; Voltage: *; ClassName: *; Value: 4K7
R103 = Chip_Res: PartNumber: RC0402FR-1347KL; ComponentType: SMD Chip Resistor; Manufacter: *; Voltage: *; ClassName: *; Value: 47K
VD17 = ZenerDiode: ComponentType: *; Manufacter: *; Package: SOD323; PartNumber: BZT52C3V3; ClassName: *; Value: BZT52C3V3
VD21 = Diode: PartNumber: PMEG4010CEJ.115; ComponentType: *; Manufacter: *; Package: SOD323; ClassName: *
D17 = FUSB302BMPX: ComponentType: SMD Chip Resistor; Manufacter: *; Voltage: *; ClassName: *; Tolerance: *; PartNumber: FUSB302BMPX; Package: WQFN14; Value: FUSB302BMPX
D18 = SY6280AAAC: ComponentType: SMD Chip Resistor; Manufacter: *; Voltage: *; ClassName: *; Tolerance: *; PartNumber: SY6280AAAC; Package: SOT23-5; Value: SY6280AAAC
U1 = RK3399_FF: Package: BGA828; ComponentType: *; Manufacter: *; PartNumber: RK3399; ClassName: *
VD16 VD18-VD20 VD23 VD24 = RCLAMP0524PA: ComponentType: *; Manufacter: *; Package: RCLAMP0524PA; PartNumber: RCLAMP0524PA; ClassName: *; Value: RCLAMP0524PA
VD22 = TVS_Diode: ComponentType: *; Manufacter: *; Package: SOD323; PartNumber: UDD32C05L01; ClassName: *

## Sheet 13 CPU_1.SchDoc
size 420 x 297 mm; Address1: Address1; Address2: Address2; Address3: Address3; Address4: Address4; DocumentNumber: АБВГ.123456.001 Э3; SheetNumber: 13; SheetTotal: 23; Scale: 1:1; DocumentType: Схема электрическая принципиальная; FirstReferrence: АБВГ.123456.001
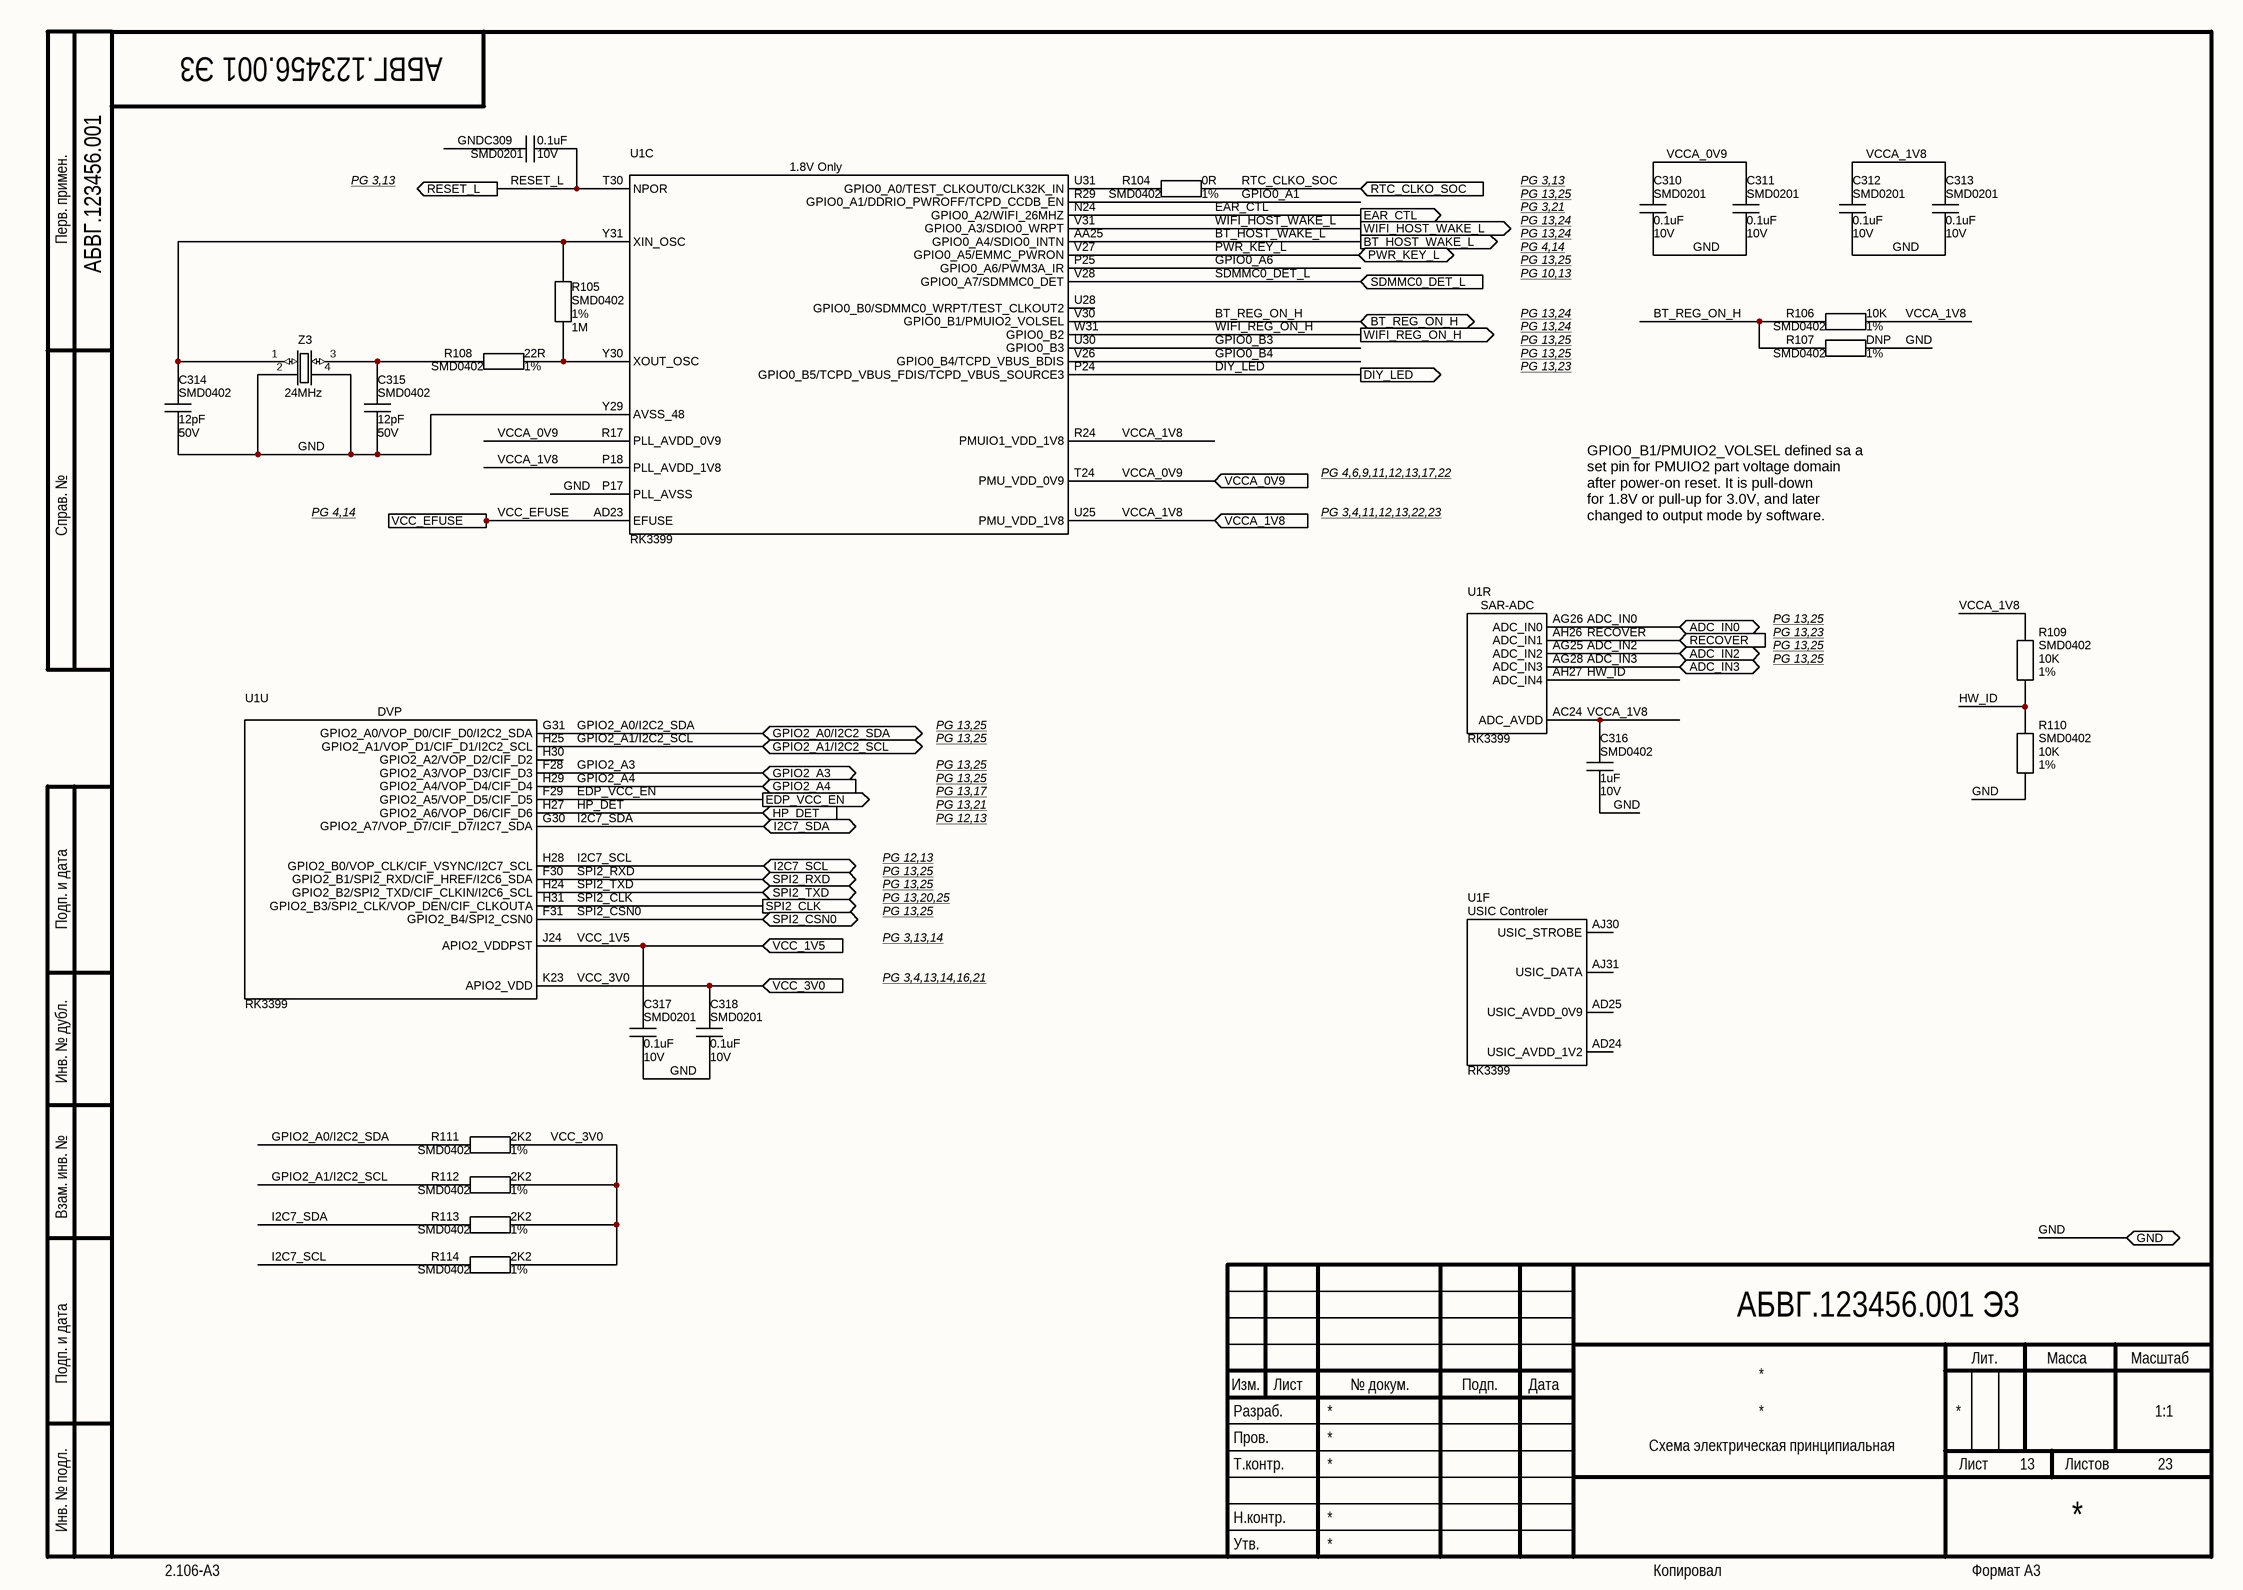
[diagram p12: 13 CPU_1.SchDoc]

### Parts
C309  Package: SMD0201  Voltage: 10V  [CAP_SMD_0201]  (hidden comment: 0.1uF)
C310  Package: SMD0201  Voltage: 10V  [CAP_SMD_0201]  (hidden comment: 0.1uF)
C311  Package: SMD0201  Voltage: 10V  [CAP_SMD_0201]  (hidden comment: 0.1uF)
C312  Package: SMD0201  Voltage: 10V  [CAP_SMD_0201]  (hidden comment: 0.1uF)
C313  Package: SMD0201  Voltage: 10V  [CAP_SMD_0201]  (hidden comment: 0.1uF)
C314  Package: SMD0402  Voltage: 50V  [CAP_SMD_0402]  (hidden comment: 12pF)
C315  Package: SMD0402  Voltage: 50V  [CAP_SMD_0402]  (hidden comment: 12pF)
C316  Package: SMD0402  Voltage: 10V  [CAP_SMD_0402_small]  (hidden comment: 1uF)
C317  Package: SMD0201  Voltage: 10V  [CAP_SMD_0201]  (hidden comment: 0.1uF)
C318  Package: SMD0201  Voltage: 10V  [CAP_SMD_0201]  (hidden comment: 0.1uF)
R104  Package: SMD0402  Tolerance: 1%  [RES_SMD_0402]  (hidden comment: 0R)
R105  Package: SMD0402  Tolerance: 1%  [RES_SMD_0402]  (hidden comment: 1M)
R106  Package: SMD0402  Tolerance: 1%  [RES_SMD_0402]  (hidden comment: 10K)
R107  Package: SMD0402  Tolerance: 1%  [RES_SMD_0402]  (hidden comment: DNP)
R108  Package: SMD0402  Tolerance: 1%  [RES_SMD_0402]  (hidden comment: 22R)
R109  Package: SMD0402  Tolerance: 1%  [RES_SMD_0402]  (hidden comment: 10K)
R110  Package: SMD0402  Tolerance: 1%  [RES_SMD_0402]  (hidden comment: 10K)
R111  Package: SMD0402  Tolerance: 1%  [RES_SMD_0402]  (hidden comment: 2K2)
R112  Package: SMD0402  Tolerance: 1%  [RES_SMD_0402]  (hidden comment: 2K2)
R113  Package: SMD0402  Tolerance: 1%  [RES_SMD_0402]  (hidden comment: 2K2)
R114  Package: SMD0402  Tolerance: 1%  [RES_SMD_0402]  (hidden comment: 2K2)
U1  value RK3399  [BGA828C65P31X31_2100X2100X161N]  (hidden comment: RK3399_FF)  (parts C,F,R,U of 23)
Z3  value 24MHz  [TSX3225]  (hidden comment: Value)

### Ports
ADC_IN0 (bidir), ADC_IN2 (bidir), ADC_IN3 (bidir), BT_HOST_WAKE_L (out), BT_REG_ON_H (bidir), DIY_LED (out), EAR_CTL (out), EDP_VCC_EN (out), GND (bidir), GPIO2_A0/I2C2_SDA (bidir), GPIO2_A1/I2C2_SCL (bidir), GPIO2_A3 (bidir), GPIO2_A4 (in), HP_DET (in), I2C7_SCL (bidir), I2C7_SDA (bidir), PWR_KEY_L (bidir), RECOVER (in), RESET_L (out), RTC_CLKO_SOC (in), SDMMC0_DET_L (in), SPI2_CLK (out), SPI2_CSN0 (bidir), SPI2_RXD (bidir), SPI2_TXD (bidir), VCC_1V5 (in), VCC_3V0 (in), VCC_EFUSE (in), VCCA_0V9 (in), VCCA_1V8 (in), WIFI_HOST_WAKE_L (out), WIFI_REG_ON_H (out)

### Nets
ADC_IN0: U1.AG26(ADC_IN0) ; port ADC_IN0
ADC_IN2: U1.AG25(ADC_IN2) ; port ADC_IN2
ADC_IN3: U1.AG28(ADC_IN3) ; port ADC_IN3
BT_HOST_WAKE_L: U1.AA25(GPIO0_A4/SDIO0_INTN) ; port BT_HOST_WAKE_L
BT_REG_ON_H: R106.2 R107.1 U1.V30(GPIO0_B1/PMUIO2_VOLSEL) ; port BT_REG_ON_H
DIY_LED: U1.P24(GPIO0_B5/TCPD_VBUS_FDIS/TCPD_VBUS_SOURCE3) ; port DIY_LED
EAR_CTL: U1.N24(GPIO0_A2/WIFI_26MHZ) ; port EAR_CTL
EDP_VCC_EN: U1.F29(GPIO2_A5/VOP_D5/CIF_D5) ; port EDP_VCC_EN
GND: C309.1 C310.2 C311.2 C312.2 C313.2 C314.2 C315.2 C316.2 C317.2 C318.2 R107.2 R110.1 U1.P17(PLL_AVSS) U1.Y29(AVSS_48) Z3.2(GND) Z3.4(GND) ; port GND
GPIO0_A1: U1.R29(GPIO0_A1/DDRIO_PWROFF/TCPD_CCDB_EN)
GPIO0_A6: U1.P25(GPIO0_A6/PWM3A_IR)
GPIO0_B3: U1.U30(GPIO0_B3)
GPIO0_B4: U1.V26(GPIO0_B4/TCPD_VBUS_BDIS)
GPIO2_A0/I2C2_SDA: R111.2 U1.G31(GPIO2_A0/VOP_D0/CIF_D0/I2C2_SDA) ; port GPIO2_A0/I2C2_SDA
GPIO2_A1/I2C2_SCL: R112.2 U1.H25(GPIO2_A1/VOP_D1/CIF_D1/I2C2_SCL) ; port GPIO2_A1/I2C2_SCL
GPIO2_A3: U1.F28(GPIO2_A3/VOP_D3/CIF_D3) ; port GPIO2_A3
GPIO2_A4: U1.H29(GPIO2_A4/VOP_D4/CIF_D4) ; port GPIO2_A4
HP_DET: U1.H27(GPIO2_A6/VOP_D6/CIF_D6) ; port HP_DET
HW_ID: R109.1 R110.2 U1.AH27(ADC_IN4)
I2C7_SCL: R114.2 U1.H28(GPIO2_B0/VOP_CLK/CIF_VSYNC/I2C7_SCL) ; port I2C7_SCL
I2C7_SDA: R113.2 U1.G30(GPIO2_A7/VOP_D7/CIF_D7/I2C7_SDA) ; port I2C7_SDA
PWR_KEY_L: U1.V27(GPIO0_A5/EMMC_PWRON) ; port PWR_KEY_L
RECOVER: U1.AH26(ADC_IN1) ; port RECOVER
RESET_L: C309.2 U1.T30(NPOR) ; port RESET_L
RTC_CLKO_SOC: R104.2 ; port RTC_CLKO_SOC
SDMMC0_DET_L: U1.V28(GPIO0_A7/SDMMC0_DET) ; port SDMMC0_DET_L
SPI2_CLK: U1.H31(GPIO2_B3/SPI2_CLK/VOP_DEN/CIF_CLKOUTA) ; port SPI2_CLK
SPI2_CSN0: U1.F31(GPIO2_B4/SPI2_CSN0) ; port SPI2_CSN0  [project net CAN_CS]
SPI2_RXD: U1.F30(GPIO2_B1/SPI2_RXD/CIF_HREF/I2C6_SDA) ; port SPI2_RXD
SPI2_TXD: U1.H24(GPIO2_B2/SPI2_TXD/CIF_CLKIN/I2C6_SCL) ; port SPI2_TXD
VCC_1V5: C317.1 U1.J24(APIO2_VDDPST) ; port VCC_1V5
VCC_3V0: C318.1 R111.1 R112.1 R113.1 R114.1 U1.K23(APIO2_VDD) ; port VCC_3V0
VCC_EFUSE: U1.AD23(EFUSE) ; port VCC_EFUSE
VCCA_0V9: C310.1 C311.1 U1.R17(PLL_AVDD_0V9) U1.T24(PMU_VDD_0V9) ; port VCCA_0V9
VCCA_1V8: C312.1 C313.1 C316.1 R106.1 R109.2 U1.AC24(ADC_AVDD) U1.P18(PLL_AVDD_1V8) U1.R24(PMUIO1_VDD_1V8) U1.U25(PMU_VDD_1V8) ; port VCCA_1V8
WIFI_HOST_WAKE_L: U1.V31(GPIO0_A3/SDIO0_WRPT) ; port WIFI_HOST_WAKE_L
WIFI_REG_ON_H: U1.W31(GPIO0_B2) ; port WIFI_REG_ON_H
NetC314_1: C314.1 R105.2 U1.Y31(XIN_OSC) Z3.1(IN/OUT)
NetC315_1: C315.1 R108.2 Z3.3(IN/OUT)
NetR104_1: R104.1 U1.U31(GPIO0_A0/TEST_CLKOUT0/CLK32K_IN)
NetR105_1: R105.1 R108.1 U1.Y30(XOUT_OSC)

Not connected (* = marked no-connect by the designer): U1 AD24(USIC_AVDD_1V2) AD25(USIC_AVDD_0V9) AJ30(USIC_STROBE) AJ31(USIC_DATA) H30(GPIO2_A2/VOP_D2/CIF_D2) U28(GPIO0_B0/SDMMC0_WRPT/TEST_CLKOUT2)

### Notes on the sheet
- PG 3,13
- Перв. примен.
- PG 4,14
- PG 3,21
- PG 13,24
- PG 13,25
- PG 10,13
- PG 13,23
- Справ. №
- PG 3,4,11,12,13,22,23
- PG 4,6,9,11,12,13,17,22
- GPIO0_B1/PMUIO2_VOLSEL defined sa a
  set pin for PMUIO2 part voltage domain
  after power-on reset. It is pull-down
  for 1.8V or pull-up for 3.0V, and later
  changed to output mode by software.
- PG 13,17
- PG 12,13
- PG 13,21
- Подп. и дата
- PG 13,20,25
- PG 3,13,14
- PG 3,4,13,14,16,21
- Инв. № дубл.
- Взам. инв. №
- Разраб.
- Изм.
- Лист
- № докум.
- Подп.
- Дата
- Лит.
- Масса
- Масштаб
- Пров.
- Т.контр.
- Листов
- Инв. № подл.
- Утв.
- Н.контр.
- 2.106-A3
- Копировал
- Формат А3
- (in symbol RK3399_FF, part C) 1.8V Only
- (in symbol RK3399_FF, part F) USIC Controler
- (in symbol RK3399_FF, part R) SAR-ADC
- (in symbol RK3399_FF, part U) DVP

### Library data of the parts
C309-C313 C317 C318 = Ceramic_Cap: PartNumber: CC0201KRX5R6BB104; ComponentType: SMD Ceramic Chip Capacitor; Manufacter: *; Tolerance: *; ClassName: *; Value: 0.1uF
C314 C315 = Ceramic_Cap: PartNumber: CC0402JRNPO9BN120; ComponentType: SMD Ceramic Chip Capacitor; Manufacter: *; Tolerance: *; ClassName: *; Value: 12pF
C316 = Ceramic_Cap: PartNumber: CC0402KRX5R6BB105; ComponentType: SMD Ceramic Chip Capacitor; Manufacter: *; Tolerance: *; ClassName: Solder_Clearence; Value: 1uF
R104 = Chip_Res: PartNumber: RC0402FR-070RL; ComponentType: SMD Chip Resistor; Manufacter: *; Voltage: *; ClassName: *; Value: 0R
R105 = Chip_Res: PartNumber: RC0402FR-071ML; ComponentType: SMD Chip Resistor; Manufacter: *; Voltage: *; ClassName: *; Value: 1M
R106 R109 R110 = Chip_Res: PartNumber: RC0402FR-0710KL; ComponentType: SMD Chip Resistor; Manufacter: *; Voltage: *; ClassName: *; Value: 10K
R107 = Chip_Res: PartNumber: Do Not Place; ComponentType: SMD Chip Resistor; Manufacter: *; Voltage: *; ClassName: *; Value: DNP
R108 = Chip_Res: PartNumber: RC0402FR-0722RL; ComponentType: SMD Chip Resistor; Manufacter: *; Voltage: *; ClassName: *; Value: 22R
R111-R114 = Chip_Res: PartNumber: RC0402FR-072K2L; ComponentType: SMD Chip Resistor; Manufacter: *; Voltage: *; ClassName: *; Value: 2K2
Z3 = OSC3225: PartNumber: 12.88665; ComponentType: *; Manufacter: *; Package: TSX3225
U1 = RK3399_FF: Package: BGA828; ComponentType: *; Manufacter: *; PartNumber: RK3399; ClassName: *

## Sheet 14 CPU_2.SchDoc
size 420 x 297 mm; Address1: Address1; Address2: Address2; Address3: Address3; Address4: Address4; DocumentNumber: АБВГ.123456.001 Э3; SheetNumber: 14; SheetTotal: 23; Scale: 1:1; DocumentType: Схема электрическая принципиальная; FirstReferrence: АБВГ.123456.001
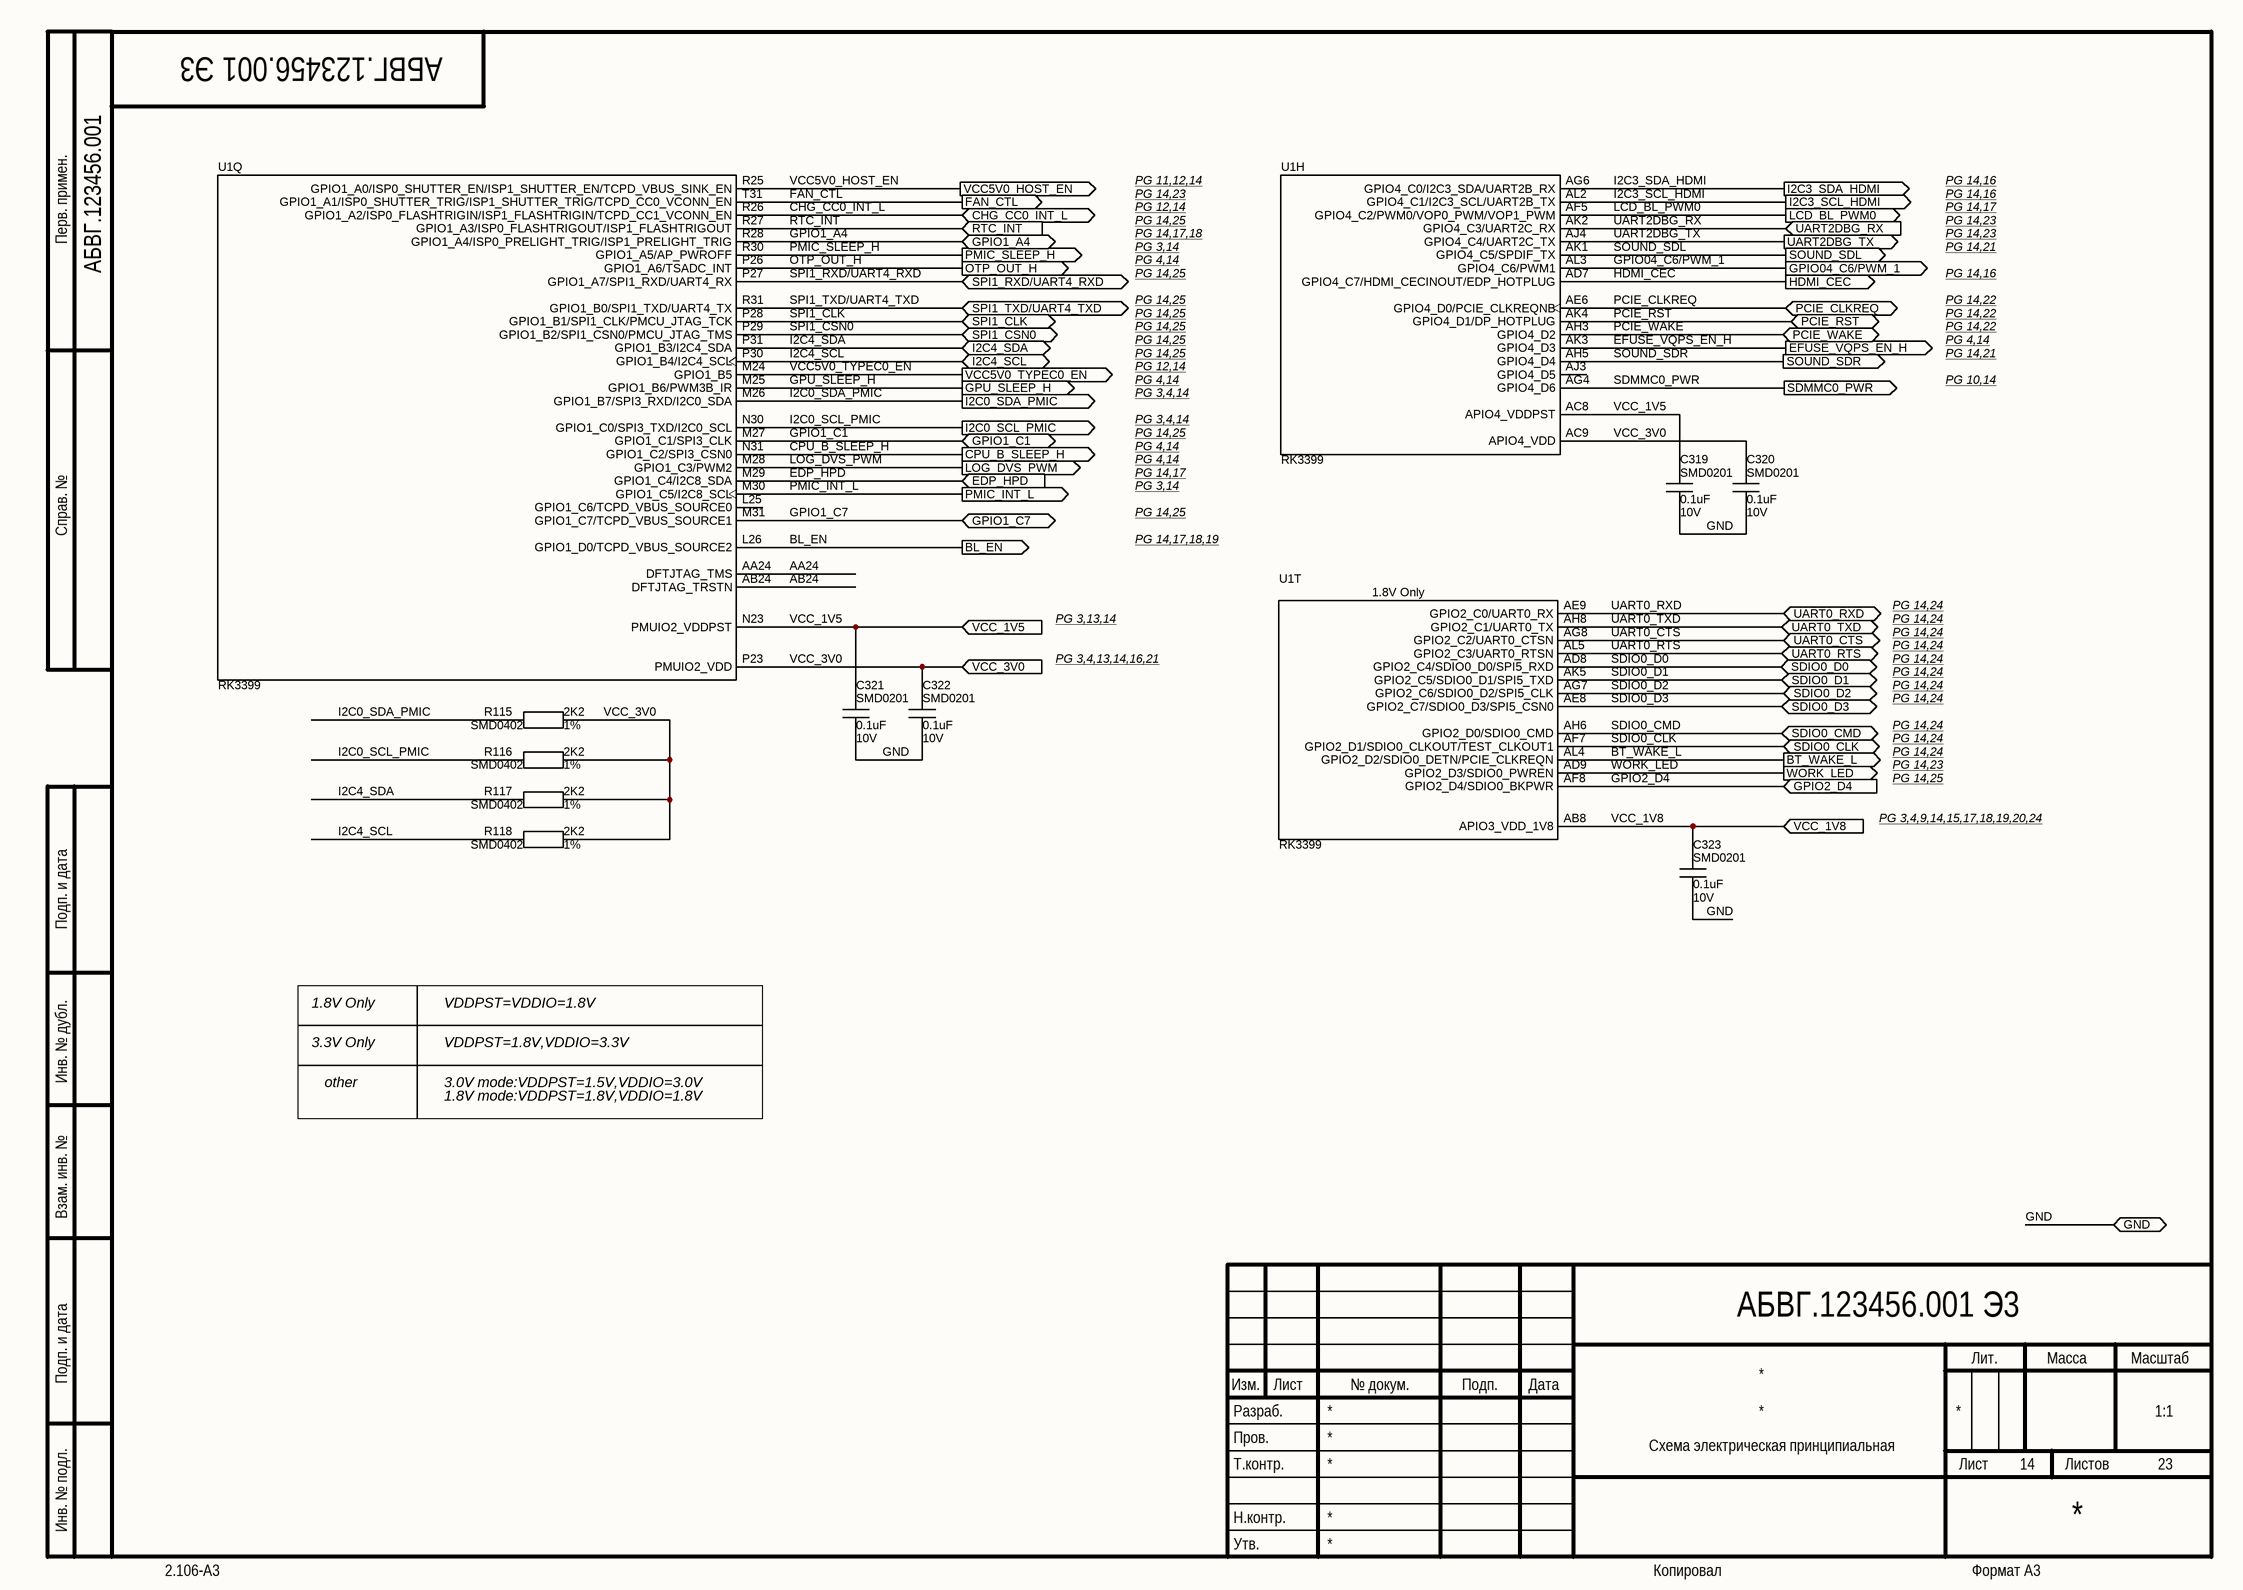
[diagram p13: 14 CPU_2.SchDoc]

### Parts
C319  Package: SMD0201  Voltage: 10V  [CAP_SMD_0201]  (hidden comment: 0.1uF)
C320  Package: SMD0201  Voltage: 10V  [CAP_SMD_0201]  (hidden comment: 0.1uF)
C321  Package: SMD0201  Voltage: 10V  [CAP_SMD_0201]  (hidden comment: 0.1uF)
C322  Package: SMD0201  Voltage: 10V  [CAP_SMD_0201]  (hidden comment: 0.1uF)
C323  Package: SMD0201  Voltage: 10V  [CAP_SMD_0201]  (hidden comment: 0.1uF)
R115  Package: SMD0402  Tolerance: 1%  [RES_SMD_0402]  (hidden comment: 2K2)
R116  Package: SMD0402  Tolerance: 1%  [RES_SMD_0402]  (hidden comment: 2K2)
R117  Package: SMD0402  Tolerance: 1%  [RES_SMD_0402]  (hidden comment: 2K2)
R118  Package: SMD0402  Tolerance: 1%  [RES_SMD_0402]  (hidden comment: 2K2)
U1  value RK3399  [BGA828C65P31X31_2100X2100X161N]  (hidden comment: RK3399_FF)  (parts H,Q,T of 23)

### Ports
BL_EN (out), BT_WAKE_L (out), CHG_CC0_INT_L (bidir), CPU_B_SLEEP_H (out), EDP_HPD (in), EFUSE_VQPS_EN_H (out), FAN_CTL (out), GND (bidir), GPIO1_A4 (bidir), GPIO1_C1 (bidir), GPIO1_C7 (bidir), GPIO2_D4 (in), GPIO04_C6/PWM_1 (out), GPU_SLEEP_H (out), HDMI_CEC (out), I2C0_SCL_PMIC (out), I2C0_SDA_PMIC (out), I2C3_SCL_HDMI (out), I2C3_SDA_HDMI (out), I2C4_SCL (bidir), I2C4_SDA (bidir), LCD_BL_PWM0 (out), LOG_DVS_PWM (out), OTP_OUT_H (out), PCIE_CLKREQ (bidir), PCIE_RST (bidir), PCIE_WAKE (bidir), PMIC_INT_L (out), PMIC_SLEEP_H (out), RTC_INT (in), SDIO0_CLK (bidir), SDIO0_CMD (bidir), SDIO0_D0 (bidir), SDIO0_D1 (bidir), SDIO0_D2 (bidir), SDIO0_D3 (bidir), SDMMC0_PWR (out), SOUND_SDL (out), SOUND_SDR (out), SPI1_CLK (bidir), SPI1_CSN0 (bidir), SPI1_RXD/UART4_RXD (bidir), SPI1_TXD/UART4_TXD (bidir), UART0_CTS (bidir), UART0_RTS (bidir), UART0_RXD (bidir), UART0_TXD (bidir), UART2DBG_RX (in), UART2DBG_TX (out), VCC5V0_HOST_EN (out), VCC5V0_TYPEC0_EN (out), VCC_1V5 (in), VCC_1V8 (in), VCC_3V0 (in), WORK_LED (out)

### Nets
AA24: U1.AA24(DFTJTAG_TMS)
AB24: U1.AB24(DFTJTAG_TRSTN)
BL_EN: U1.L26(GPIO1_D0/TCPD_VBUS_SOURCE2) ; port BL_EN
BT_WAKE_L: U1.AL4(GPIO2_D2/SDIO0_DETN/PCIE_CLKREQN) ; port BT_WAKE_L
CHG_CC0_INT_L: U1.R26(GPIO1_A2/ISP0_FLASHTRIGIN/ISP1_FLASHTRIGIN/TCPD_CC1_VCONN_EN) ; port CHG_CC0_INT_L
CPU_B_SLEEP_H: U1.N31(GPIO1_C2/SPI3_CSN0) ; port CPU_B_SLEEP_H
EDP_HPD: U1.M29(GPIO1_C4/I2C8_SDA) ; port EDP_HPD
EFUSE_VQPS_EN_H: U1.AK3(GPIO4_D3) ; port EFUSE_VQPS_EN_H
FAN_CTL: U1.T31(GPIO1_A1/ISP0_SHUTTER_TRIG/ISP1_SHUTTER_TRIG/TCPD_CC0_VCONN_EN) ; port FAN_CTL
GND: C319.2 C320.2 C321.2 C322.2 C323.2 ; port GND
GPIO1_A4: U1.R28(GPIO1_A4/ISP0_PRELIGHT_TRIG/ISP1_PRELIGHT_TRIG) ; port GPIO1_A4
GPIO1_C1: U1.M27(GPIO1_C1/SPI3_CLK) ; port GPIO1_C1
GPIO1_C7: U1.M31(GPIO1_C7/TCPD_VBUS_SOURCE1) ; port GPIO1_C7
GPIO2_D4: U1.AF8(GPIO2_D4/SDIO0_BKPWR) ; port GPIO2_D4
GPIO04_C6/PWM_1: U1.AL3(GPIO4_C6/PWM1) ; port GPIO04_C6/PWM_1
GPU_SLEEP_H: U1.M25(GPIO1_B6/PWM3B_IR) ; port GPU_SLEEP_H
HDMI_CEC: U1.AD7(GPIO4_C7/HDMI_CECINOUT/EDP_HOTPLUG) ; port HDMI_CEC
I2C0_SCL_PMIC: R116.2 U1.N30(GPIO1_C0/SPI3_TXD/I2C0_SCL) ; port I2C0_SCL_PMIC
I2C0_SDA_PMIC: R115.2 U1.M26(GPIO1_B7/SPI3_RXD/I2C0_SDA) ; port I2C0_SDA_PMIC
I2C3_SCL_HDMI: U1.AL2(GPIO4_C1/I2C3_SCL/UART2B_TX) ; port I2C3_SCL_HDMI
I2C3_SDA_HDMI: U1.AG6(GPIO4_C0/I2C3_SDA/UART2B_RX) ; port I2C3_SDA_HDMI
I2C4_SCL: R118.2 U1.P30(GPIO1_B4/I2C4_SCL) ; port I2C4_SCL
I2C4_SDA: R117.2 U1.P31(GPIO1_B3/I2C4_SDA) ; port I2C4_SDA
LCD_BL_PWM0: U1.AF5(GPIO4_C2/PWM0/VOP0_PWM/VOP1_PWM) ; port LCD_BL_PWM0
LOG_DVS_PWM: U1.M28(GPIO1_C3/PWM2) ; port LOG_DVS_PWM
OTP_OUT_H: U1.P26(GPIO1_A6/TSADC_INT) ; port OTP_OUT_H
PCIE_CLKREQ: U1.AE6(GPIO4_D0/PCIE_CLKREQNB) ; port PCIE_CLKREQ
PCIE_RST: U1.AK4(GPIO4_D1/DP_HOTPLUG) ; port PCIE_RST
PCIE_WAKE: U1.AH3(GPIO4_D2) ; port PCIE_WAKE
PMIC_INT_L: U1.M30(GPIO1_C5/I2C8_SCL) ; port PMIC_INT_L
PMIC_SLEEP_H: U1.R30(GPIO1_A5/AP_PWROFF) ; port PMIC_SLEEP_H
RTC_INT: U1.R27(GPIO1_A3/ISP0_FLASHTRIGOUT/ISP1_FLASHTRIGOUT) ; port RTC_INT
SDIO0_CLK: U1.AF7(GPIO2_D1/SDIO0_CLKOUT/TEST_CLKOUT1) ; port SDIO0_CLK
SDIO0_CMD: U1.AH6(GPIO2_D0/SDIO0_CMD) ; port SDIO0_CMD
SDIO0_D0: U1.AD8(GPIO2_C4/SDIO0_D0/SPI5_RXD) ; port SDIO0_D0
SDIO0_D1: U1.AK5(GPIO2_C5/SDIO0_D1/SPI5_TXD) ; port SDIO0_D1
SDIO0_D2: U1.AG7(GPIO2_C6/SDIO0_D2/SPI5_CLK) ; port SDIO0_D2
SDIO0_D3: U1.AE8(GPIO2_C7/SDIO0_D3/SPI5_CSN0) ; port SDIO0_D3
SDMMC0_PWR: U1.AG4(GPIO4_D6) ; port SDMMC0_PWR
SOUND_SDL: U1.AK1(GPIO4_C5/SPDIF_TX) ; port SOUND_SDL
SOUND_SDR: U1.AH5(GPIO4_D4) ; port SOUND_SDR
SPI1_CLK: U1.P28(GPIO1_B1/SPI1_CLK/PMCU_JTAG_TCK) ; port SPI1_CLK
SPI1_CSN0: U1.P29(GPIO1_B2/SPI1_CSN0/PMCU_JTAG_TMS) ; port SPI1_CSN0
SPI1_RXD/UART4_RXD: U1.P27(GPIO1_A7/SPI1_RXD/UART4_RX) ; port SPI1_RXD/UART4_RXD
SPI1_TXD/UART4_TXD: U1.R31(GPIO1_B0/SPI1_TXD/UART4_TX) ; port SPI1_TXD/UART4_TXD
UART0_CTS: U1.AG8(GPIO2_C2/UART0_CTSN) ; port UART0_CTS
UART0_RTS: U1.AL5(GPIO2_C3/UART0_RTSN) ; port UART0_RTS
UART0_RXD: U1.AE9(GPIO2_C0/UART0_RX) ; port UART0_RXD
UART0_TXD: U1.AH8(GPIO2_C1/UART0_TX) ; port UART0_TXD
UART2DBG_RX: U1.AK2(GPIO4_C3/UART2C_RX) ; port UART2DBG_RX
UART2DBG_TX: U1.AJ4(GPIO4_C4/UART2C_TX) ; port UART2DBG_TX
VCC5V0_HOST_EN: U1.R25(GPIO1_A0/ISP0_SHUTTER_EN/ISP1_SHUTTER_EN/TCPD_VBUS_SINK_EN) ; port VCC5V0_HOST_EN
VCC5V0_TYPEC0_EN: U1.M24(GPIO1_B5) ; port VCC5V0_TYPEC0_EN
VCC_1V5: C319.1 C321.1 U1.AC8(APIO4_VDDPST) U1.N23(PMUIO2_VDDPST) ; port VCC_1V5
VCC_1V8: C323.1 U1.AB8(APIO3_VDD_1V8) ; port VCC_1V8
VCC_3V0: C320.1 C322.1 R115.1 R116.1 R117.1 R118.1 U1.AC9(APIO4_VDD) U1.P23(PMUIO2_VDD) ; port VCC_3V0
WORK_LED: U1.AD9(GPIO2_D3/SDIO0_PWREN) ; port WORK_LED

Not connected (* = marked no-connect by the designer): U1 AJ3(GPIO4_D5) L25(GPIO1_C6/TCPD_VBUS_SOURCE0)

### Notes on the sheet
- PG 11,12,14
- PG 14,16
- Перв. примен.
- PG 3,14
- PG 12,14
- PG 14,17,18
- PG 14,23
- PG 14,25
- PG 14,17
- PG 14,21
- PG 4,14
- PG 14,22
- PG 3,4,14
- PG 10,14
- Справ. №
- PG 14,17,18,19
- PG 3,13,14
- PG 3,4,13,14,16,21
- PG 14,24
- PG 3,4,9,14,15,17,18,19,20,24
- Подп. и дата
- 1.8V Only
- 3.3V Only
- VDDPST=VDDIO=1.8V
- VDDPST=1.8V,VDDIO=3.3V
- Инв. № дубл.
- other
- 3.0V mode:VDDPST=1.5V,VDDIO=3.0V
- 1.8V mode:VDDPST=1.8V,VDDIO=1.8V
- Взам. инв. №
- Разраб.
- Изм.
- Лист
- № докум.
- Подп.
- Дата
- Лит.
- Масса
- Масштаб
- Пров.
- Т.контр.
- Листов
- Инв. № подл.
- Утв.
- Н.контр.
- 2.106-A3
- Копировал
- Формат А3
- (in symbol RK3399_FF, part T) 1.8V Only

### Library data of the parts
C319-C323 = Ceramic_Cap: PartNumber: CC0201KRX5R6BB104; ComponentType: SMD Ceramic Chip Capacitor; Manufacter: *; Tolerance: *; ClassName: *; Value: 0.1uF
R115-R118 = Chip_Res: PartNumber: RC0402FR-072K2L; ComponentType: SMD Chip Resistor; Manufacter: *; Voltage: *; ClassName: *; Value: 2K2
U1 = RK3399_FF: Package: BGA828; ComponentType: *; Manufacter: *; PartNumber: RK3399; ClassName: *